# EAGLE board CntrlBoardV2_0 (EAGLE 7.7.0)
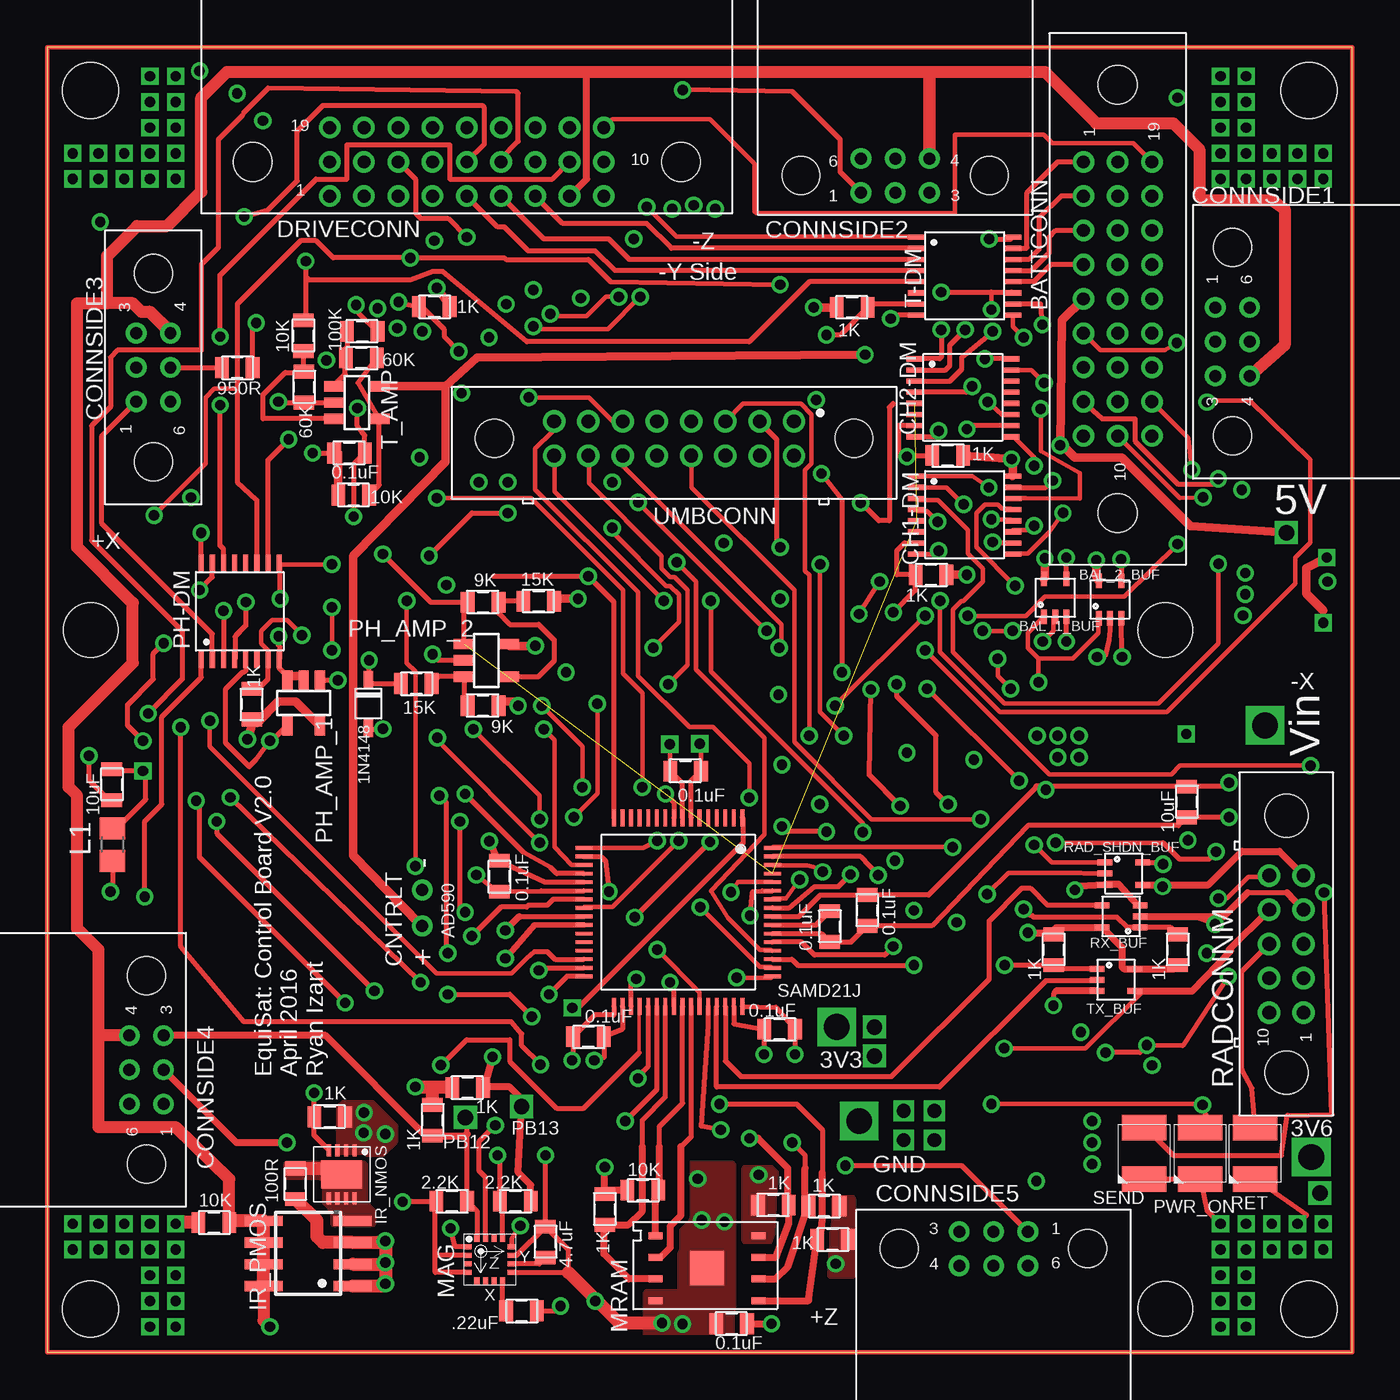
[diagram p9: board, top side]
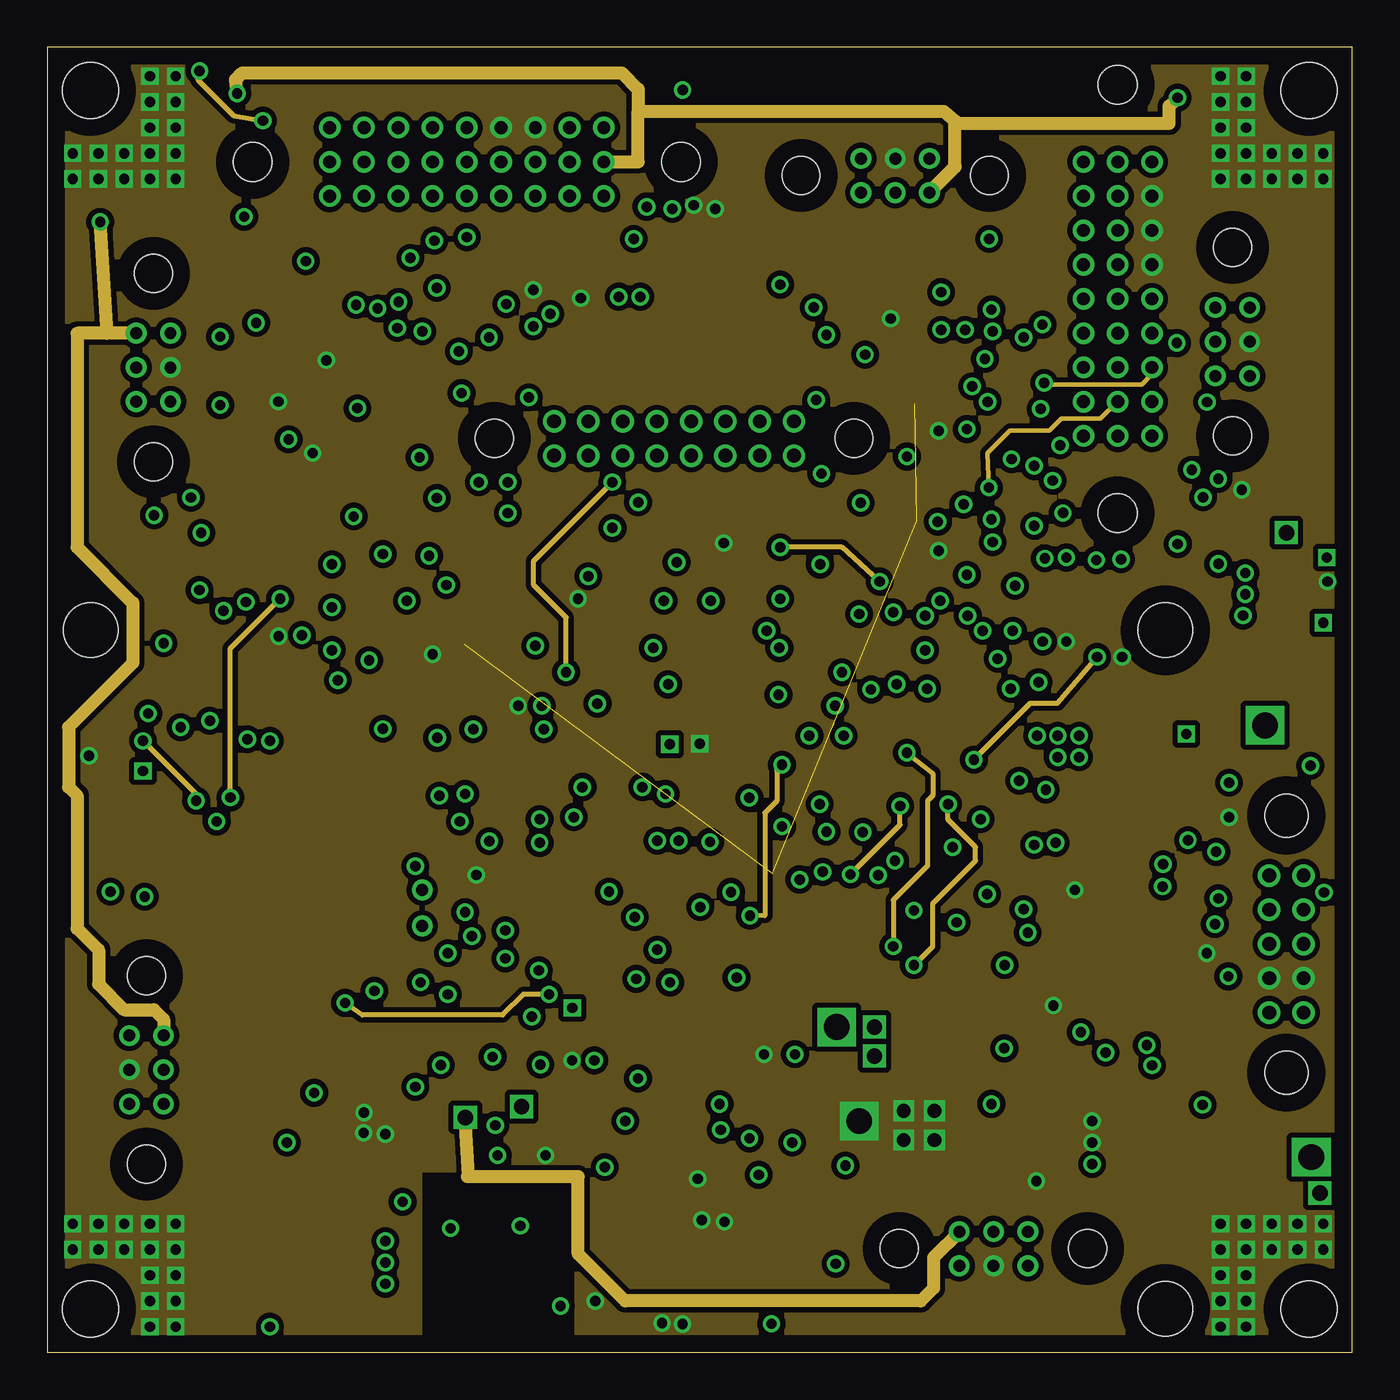
[diagram p10: board, inner layer Route2]
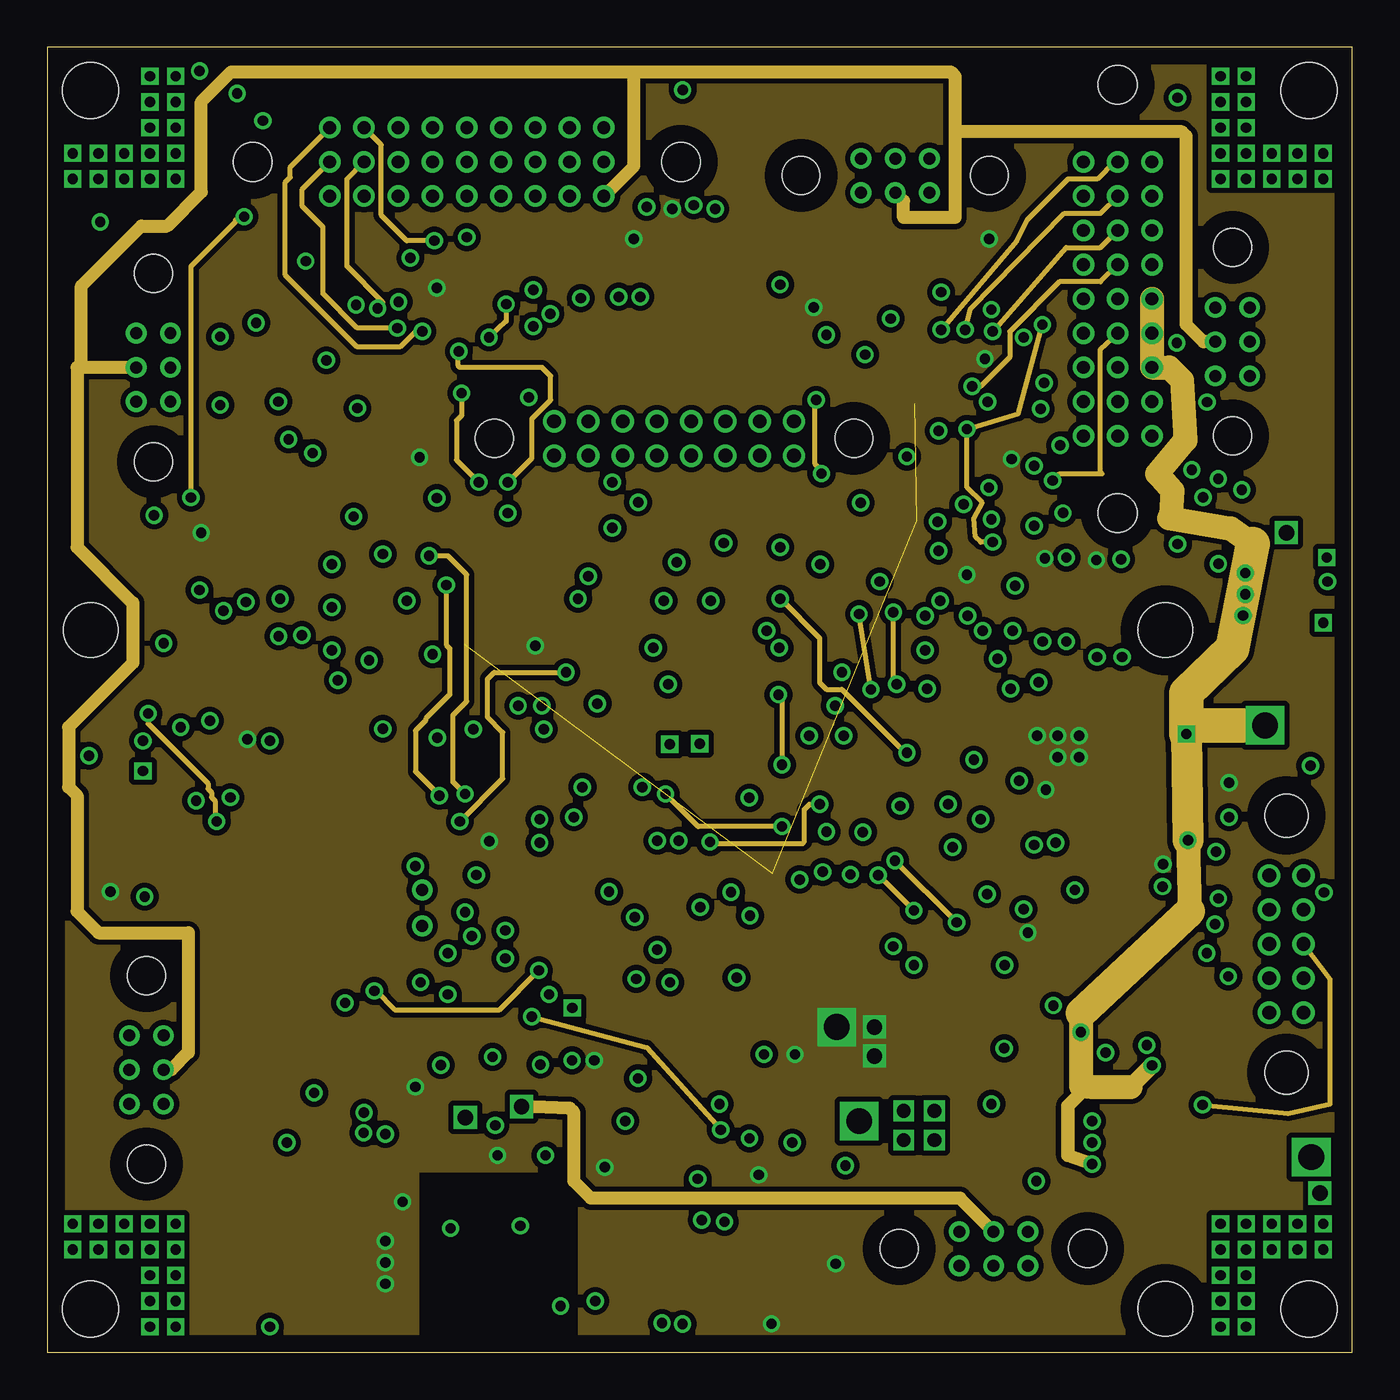
[diagram p11: board, inner layer Route3]
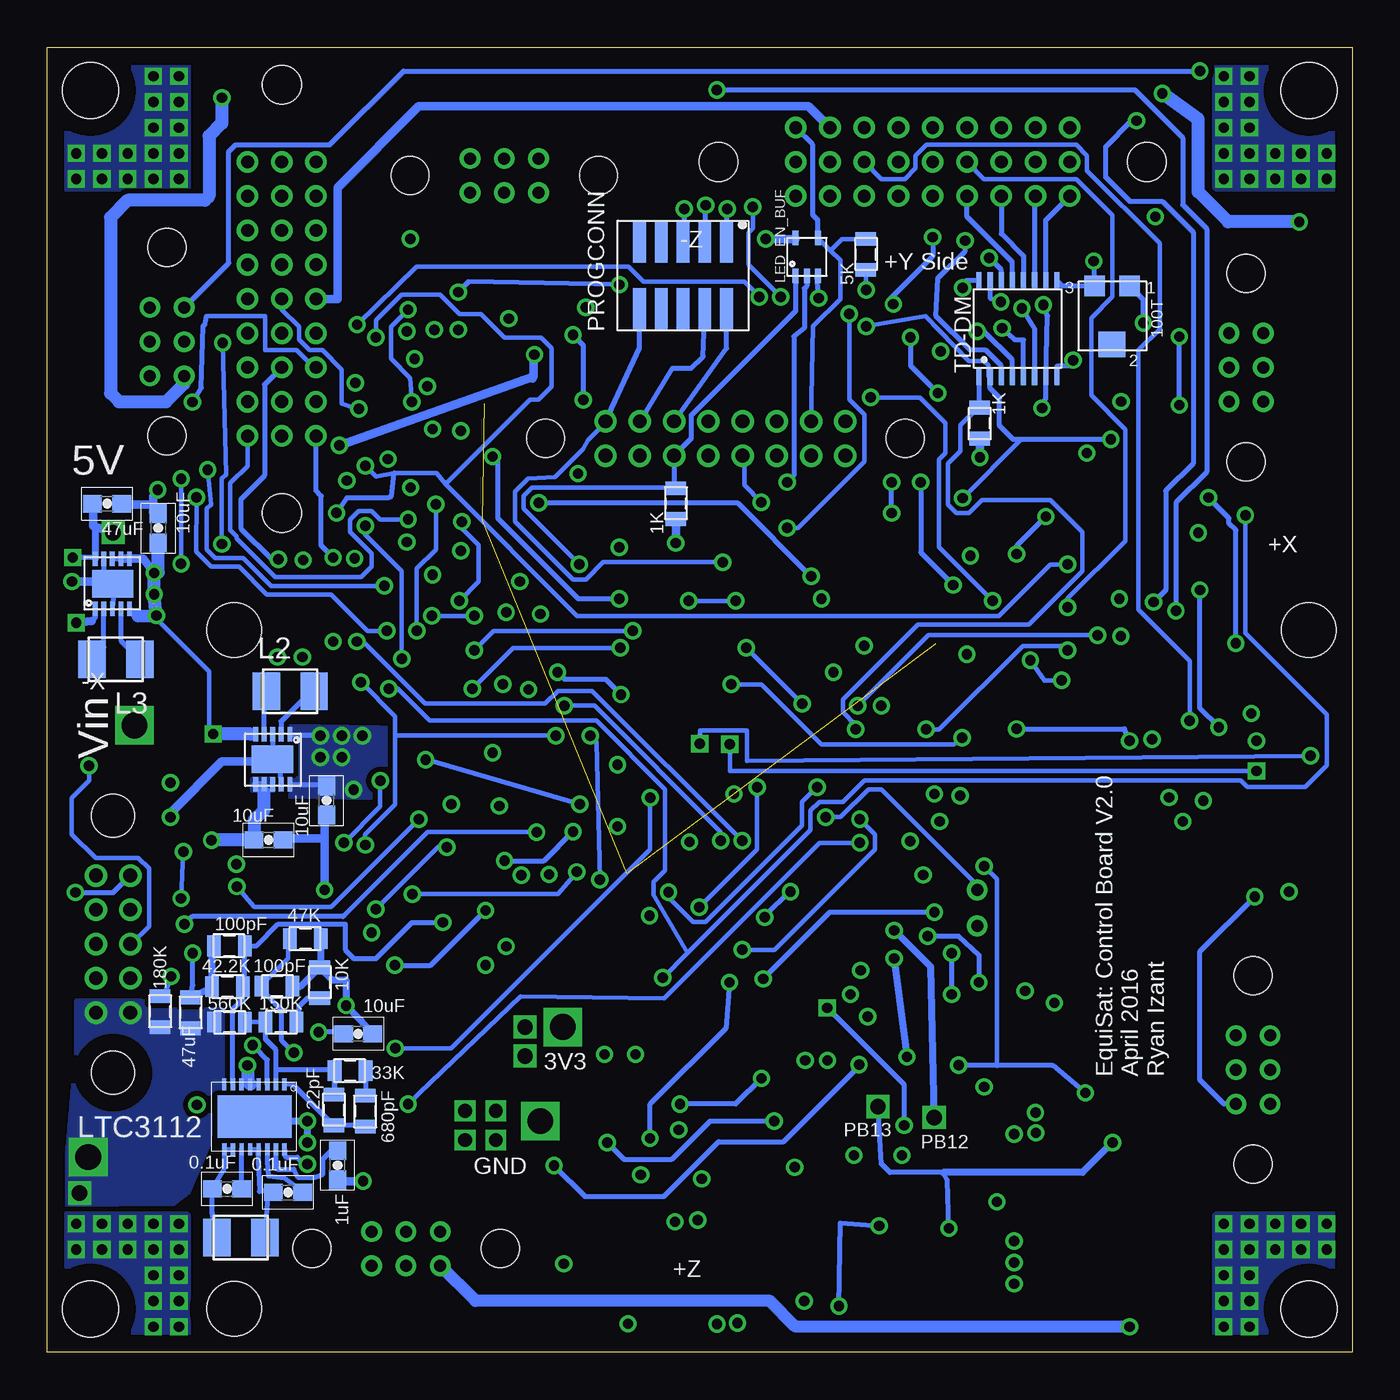
[diagram p12: board, bottom side, seen from below]

Size 76.2 x 76.2 mm. Coordinates in mm from the lower left corner, seen from the top.
Outline: 0,0 76.2,0 76.2,76.2 0,76.2 0,0
Copper layers (1*2*3*16): Top 0.035mm / dielectric 0.2mm / Route2 0.035mm / dielectric 0.2mm / Route3 0.035mm / dielectric 0.2mm / Bottom 0.035mm
Design rules "default *": minimum track width 6mil, minimum drill 15mil, track to track 5mil, track to pad 5mil, pad to pad 5mil, via to via 5mil, smd to smd 2mil, copper to edge 40mil, drill to drill 8mil, minimum pad ring 10mil, minimum via ring 8mil, stop-mask expansion 4mil, vias tented up to drill 0mil, thermal gap 10mil
Net classes: 0 default: width 0.254 mm, drill 0.203 mm, clearance 0.203 mm; 1 GND: width 0.508 mm, drill 0.254 mm, clearance 0.305 mm; 2 3V3: width 0.508 mm, drill 0.254 mm, clearance 0.305 mm; 3 3V6: width 1.016 mm, drill 0.254 mm, clearance 0.305 mm; 4 5V: width 0.508 mm, drill 0.254 mm, clearance 0.305 mm; 5 VIN: width 1.27 mm, drill 0.254 mm, clearance 0.305 mm
Holes 3.26 mm at 2.54,2.54 2.54,73.66 73.66,73.66 73.66,2.54
Holes 3.18 mm at 65.28,2.54 65.28,42.16 2.54,42.16

## Footprints (pad centres in the part's own frame; a part is rotated, then mirrored left to right if it is on the bottom)
SOD-323F = smd 0.55 x 1.05: ANODE 0,-2.8; CATHODE 0,0
TC33X-2 = smd 1.2 x 1.2: P$1 0,0; P$3 2.05,0 | smd 1.6 x 1.5: P$2 1.04,3.41
QFN10_POWERPAD = smd 0.28 x 0.85: P$1 0.14,0.441; P$2 0.641,0.441; P$3 1.141,0.442; P$4 1.639,0.439; P$5 2.139,0.442; P$6 2.14,3.359; P$7 1.639,3.359; P$8 1.139,3.355; P$9 0.641,3.355; P$10 0.139,3.358 | smd 2.4 x 1.6: PAD 1.155,1.898
SC70 = smd 0.35 x 0.85: P$1 0,0; P$2 0.65,0; P$3 1.3,0; P$4 1.3,2.2; P$5 0,2.2
HARWIN_DATAMATE_27 = drill 0.75: P$1 0,0; P$2 2,0; P$3 4,0; P$4 6,0; P$5 8,0; P$6 10,0; P$7 12,0; P$8 14,0; P$9 16,0; P$10 16,2; P$11 14,2; P$12 12,2; P$13 10,2; P$14 8,2; P$15 6,2; P$16 4,2; P$17 2,2; P$18 0,2; P$19 0,4; P$20 2,4; P$21 4,4; P$22 6,4; P$23 8,4; P$24 10,4; P$25 12,4; P$26 14,4; P$27 16,4 | hole 2.25: -4.5,2; 20.5,2
0805 = smd 0.8 x 1.2: 1 -0.9,0; 2 0.9,0
0603-CAP = smd 1.1 x 1: 1 -0.85,0; 2 0.85,0
TSSOP-16 = smd 1 x 0.3: P$1 -0.635,0; P$2 -0.635,-0.65; P$3 -0.635,-1.3; P$4 -0.635,-1.95; P$5 -0.635,-2.6; P$6 -0.635,-3.25; P$7 -0.635,-3.9; P$8 -0.635,-4.55; P$9 4.965,-4.55; P$10 4.965,-3.9; P$11 4.965,-3.25; P$12 4.965,-2.6; P$13 4.965,-1.95; P$14 4.965,-1.3; P$15 4.965,-0.65; P$16 4.965,0
AD590TH = drill 0.7: P$1 -2.1,0; P$2 0,0
HARWIN_DATAMATE_6_HOR = drill 0.7: P$1 2,1; P$2 0,1; P$3 -2,1; P$4 -2,-1; P$5 0,-1; P$6 2,-1 | hole 2.2: -5.5,0; 5.5,0
HARWIN_DATAMATE_6 = drill 0.7: P$1 -2,1; P$2 0,1; P$3 2,1; P$4 2,-1; P$5 0,-1; P$6 -2,-1 | hole 2.2: -5.5,0; 5.5,0
HARWIN_DATAMATE_27_HOR = drill 0.75: P$1 0,0; P$2 2,0; P$3 4,0; P$4 6,0; P$5 8,0; P$6 10,0; P$7 12,0; P$8 14,0; P$9 16,0; P$10 16,2; P$11 14,2; P$12 12,2; P$13 10,2; P$14 8,2; P$15 6,2; P$16 4,2; P$17 2,2; P$18 0,2; P$19 0,4; P$20 2,4; P$21 4,4; P$22 6,4; P$23 8,4; P$24 10,4; P$25 12,4; P$26 14,4; P$27 16,4 | hole 2.25: -4.5,2; 20.5,2
DFN3 = smd 0.25 x 0.7: P$1 0,0; P$2 0.5,0; P$3 1,0; P$4 1.5,0; P$5 1.5,2.8; P$6 1,2.8; P$7 0.5,2.8; P$8 0,2.8 | smd 2.38 x 1.65: P$9 0.75,1.4
SO08 = smd 0.6 x 2.2: 1 -1.905,-2.6; 2 -0.635,-2.6; 3 0.635,-2.6; 4 1.905,-2.6; 5 1.905,2.6; 6 0.635,2.6; 7 -0.635,2.6; 8 -1.905,2.6
R0805 = smd 1.3 x 1.5: 1 -0.95,0; 2 0.95,0
L3225M = smd 1.6 x 2.2: 1 -1.4,0; 2 1.4,0
DHD16 = smd 0.25 x 0.7: 1 0.125,0.35; 2 0.625,0.35; 3 1.125,0.35; 4 1.625,0.35; 5 2.125,0.35; 6 2.638,0.35; 7 3.125,0.35; 8 3.638,0.35; 9 3.625,4.15; 10 3.125,4.15; 11 2.625,4.15; 12 2.125,4.15; 13 1.625,4.15; 14 1.125,4.15; 15 0.625,4.15; 16 0.125,4.15 | smd 4.34 x 2.44: 17 1.875,2.25
HMC5883L = smd 0.45 x 0.3: 1 0.225,2.25; 2 0.225,1.75; 3 0.225,1.25; 4 0.225,0.75; 9 2.775,0.75; 10 2.775,1.25; 11 2.775,1.75; 12 2.775,2.25 | smd 0.3 x 0.45: 5 0.75,0.225; 6 1.25,0.225; 7 1.75,0.225; 8 2.25,0.225; 13 2.25,2.775; 14 1.75,2.775; 15 1.25,2.775; 16 0.75,2.775
8PXMO-229 = smd 0.813 x 0.406: P1 -3,1.895; P2 -3,0.635; P3 -3,-0.635; P4 -3,-1.895; P5 3,-1.895; P6 3,-0.635; P7 3,0.635; P8 3,1.895 | smd 2 x 2: P9 0,0
SOT23-5 = smd 0.6 x 1.2: IN+ 0.95,-1.306; IN- 0.95,1.306; OUT -0.95,-1.306; V+ -0.95,1.306; V- 0,-1.306
HARWIN_ARCHER_10_SMD = smd 0.74 x 2.4: 1 6.35,0; 2 5.08,0; 3 3.81,0; 4 2.54,0; 5 1.27,0; 6 1.27,-3.89; 7 2.54,-3.89; 8 3.81,-3.89; 9 5.08,-3.89; 10 6.35,-3.89
PLCC-2 = smd 2.6 x 1.5: A 0,0.75; C 0,-2.25
HARWIN_DATAMATE_10 = drill 0.8: P$1 0,0; P$2 2,0; P$3 4,0; P$4 6,0; P$5 8,0; P$6 8,2; P$7 6,2; P$8 4,2; P$9 2,2; P$10 0,2 | hole 2.5: -3.5,1; 11.5,1
TQFP-64 = smd 1 x 0.22: P$1 -5.5,3.5; P$2 -5.5,3; P$3 -5.5,2.5; P$4 -5.5,2; P$5 -5.5,1.5; P$6 -5.5,1; P$7 -5.5,0.5; P$8 -5.5,0; P$9 -5.5,-0.5; P$10 -5.5,-1; P$11 -5.5,-1.5; P$12 -5.5,-2; P$13 -5.5,-2.5; P$14 -5.5,-3; P$15 -5.5,-3.5; P$16 -5.5,-4; P$33 5.5,-4; P$34 5.5,-3.5; P$35 5.5,-3; P$36 5.5,-2.5; P$37 5.5,-2; P$38 5.5,-1.5; P$39 5.5,-1; P$40 5.5,-0.5; P$41 5.5,0; P$42 5.5,0.5; P$43 5.5,1; P$44 5.5,1.5; P$45 5.5,2; P$46 5.5,2.5; P$47 5.5,3; P$48 5.5,3.5 | smd 0.22 x 1: P$17 -3.75,-5.75; P$18 -3.25,-5.75; P$19 -2.75,-5.75; P$20 -2.25,-5.75; P$21 -1.75,-5.75; P$22 -1.25,-5.75; P$23 -0.75,-5.75; P$24 -0.25,-5.75; P$25 0.25,-5.75; P$26 0.75,-5.75; P$27 1.25,-5.75; P$28 1.75,-5.75; P$29 2.25,-5.75; P$30 2.75,-5.75; P$31 3.25,-5.75; P$32 3.75,-5.75; P$49 3.75,5.25; P$50 3.25,5.25; P$51 2.75,5.25; P$52 2.25,5.25; P$53 1.75,5.25; P$54 1.25,5.25; P$55 0.75,5.25; P$56 0.25,5.25; P$57 -0.25,5.25; P$58 -0.75,5.25; P$59 -1.25,5.25; P$60 -1.75,5.25; P$61 -2.25,5.25; P$62 -2.75,5.25; P$63 -3.25,5.25; P$64 -3.75,5.25
HARWIN_DATAMATE_16 = drill 0.8: P$1 0,0; P$2 2,0; P$3 4,0; P$4 6,0; P$5 8,0; P$6 10,0; P$7 12,0; P$8 14,0; P$9 14,2; P$10 12,2; P$11 10,2; P$12 8,2; P$13 6,2; P$14 4,2; P$15 2,2; P$16 0,2 | hole 2.2: -3.5,1; 17.5,1

## Placement (x,y rotation side)
1N4148  1N4148WS  [SOD-323F]  18.75,39.25 0 top
100T  TRIMPOT-TC33  [TC33X-2]  13,62.25 180 bottom
63001  TPS6300X  [QFN10_POWERPAD]  61.89,36.52 180 bottom
63002  TPS6300X  [QFN10_POWERPAD]  73.53,42.98 0 bottom
BAL_1_BUF  SN74LVC1G125  [SC70]  58.2,42.95 0 top
BAL_2_BUF  SN74LVC1G125  [SC70]  61.4,42.85 0 top
BATTCONN  HARWIN_27  [HARWIN_DATAMATE_27]  60.5,69.5 270 top
C1  4.7uF  [0805]  29.09,6.44 90 top
C2  0.1uF  [0805]  37.27,33.94 180 top
C3  0.1uF  [0805]  26.41,27.8 270 top
C4  0.1uF  [0805]  45.69,24.86 90 top
C5  0.1uF  [0805]  42.76,18.86 0 top
C6  0.1uF  [0805]  31.6,18.42 0 top
C7  0.1uF  [0805]  47.87,25.8 90 top
C8  10uF  [0805]  3.77,33.14 90 top
C9  10uF  [0805]  66.52,32.13 90 top
C10  .22uF  [0805]  27.69,2.43 0 top
C11  10uF  [0603-CAP]  59.89,32.22 90 bottom
C12  10uF  [0603-CAP]  63.28,29.91 0 bottom
C14  10uF  [0603-CAP]  69.71,48.11 270 bottom
C15  47uF  [0603-CAP]  72.7,49.54 180 bottom
C17  0.1uF  [0805]  17.65,52.5 180 top
C18  0.1uF  [0805]  39.96,1.67 180 top
C19  10uF  [0603-CAP]  58.04,18.6 0 bottom
C20  47uF  [0805]  67.83,19.82 90 bottom
C21  0.1uF  [0603-CAP]  65.7,9.55 180 bottom
C22  0.1uF  [0603-CAP]  62.14,9.34 180 bottom
C23  1uF  [0603-CAP]  59.25,10.93 90 bottom
C26  100pF  [0805]  62.78,21.37 0 bottom
C27  100pF  [0805]  65.56,23.73 180 bottom
C28  22pF  [0805]  59.47,14.15 90 bottom
C29  680pF  [0805]  57.62,14.09 270 bottom
CH1-DM  SN74CBTLV3251  [TSSOP-16]  51.4,51.15 0 top
CH2-DM  SN74CBTLV3251  [TSSOP-16]  51.3,58 0 top
CNTRLT  AD590-TH  [AD590TH]  21.9,27 90 top
CONNSIDE1  HARWIN_06_HOR  [HARWIN_DATAMATE_6_HOR]  69.2,59 90 top
CONNSIDE2  HARWIN_06_HOR  [HARWIN_DATAMATE_6_HOR]  49.51,68.7 180 top
CONNSIDE3  HARWIN_06  [HARWIN_DATAMATE_6]  6.2,57.5 90 top
CONNSIDE4  HARWIN_06_HOR  [HARWIN_DATAMATE_6_HOR]  5.8,16.5 270 top
CONNSIDE5  HARWIN_06_HOR  [HARWIN_DATAMATE_6_HOR]  55.25,6.05 0 top
DRIVECONN  HARWIN_27_HOR  [HARWIN_DATAMATE_27_HOR]  16.5,67.5 0 top
IR_NMOS  AON7522E  [DFN3]  17.95,11.8 180 top
IR_PMOS  POWERPMOS  [SO08]  15.24,5.78 90 top
L1  BLM21PG221SN1D  [R0805]  3.82,29.64 90 top
L2  2.2uH  [L3225M]  62.01,38.59 0 bottom
L3  3.3uH  [L3225M]  72.19,40.46 180 bottom
L4  4.7uH  [L3225M]  64.89,6.71 180 bottom
LED_EN_BUF  SN74LVC1G125  [SC70]  32.5,62.85 0 bottom
LTC3112  [DHD16]  62.22,16.01 180 bottom
MAG  HMC5883L  [HMC5883L]  24.34,3.92 0 top
MRAM  [8PXMO-229]  38.52,4.92 0 top
PH-DM  SN74CBTLV3251  [TSSOP-16]  9,41.1 90 top
PH_AMP_1  LT6015  [SOT23-5]  14.97,37.91 180 top
PH_AMP_2  LT6015  [SOT23-5]  25.65,40.4 270 top
PROGCONN  HARWIN_ARCHER_10_SMD  [HARWIN_ARCHER_10_SMD]  42.89,64.82 0 bottom
PWR_ON  LT-T673-Q1R2-25-Z  [PLCC-2]  67.31,12.37 0 top
R1  2.2K  [0805]  27.33,8.83 0 top
R2  2.2K  [0805]  23.62,8.83 0 top
R3  560K  [0805]  65.55,19.27 0 bottom
R4  150K  [0805]  62.55,19.29 0 bottom
R5  60K  [0805]  15,56.35 90 top
R6  47K  [0805]  61.12,24.14 180 bottom
R7  180K  [0805]  69.61,19.89 90 bottom
R8  42.2K  [0805]  65.67,21.36 0 bottom
R9  10K  [0805]  60.29,21.58 90 bottom
R10  33K  [0805]  58.51,16.44 180 bottom
R11  1K  [0805]  58.75,23.5 90 top
R12  10K  [0805]  17.9,50.05 180 top
R13  60K  [0805]  18.35,58.05 0 top
R14  100K  [0805]  18.4,59.6 180 top
R15  10K  [0805]  14.95,59.35 90 top
R16  950R  [0805]  11.1,57.49 0 top
R17  10K  [0805]  9.74,7.59 0 top
R18  1K  [0805]  21.75,54.25 270 bottom
R19  1K  [0805]  22.6,61.05 0 top
R20  1K  [0805]  47,61 180 top
R21  1K  [0805]  11.95,37.85 270 top
R22  1K  [0805]  51.6,45.4 0 top
R23  10K  [0805]  34.78,9.47 0 top
R24  1K  [0805]  24.55,15.45 180 top
R25  1K  [0805]  22.5,13.55 90 top
R26  1K  [0805]  32.55,8.35 90 top
R27  1K  [0805]  42.4,8.6 180 top
R28  1K  [0805]  45.85,6.6 0 top
R29  1K  [0805]  45.35,8.55 0 top
R30  100R  [0805]  14.5,9.85 270 top
R31  1K  [0805]  52.57,52.36 0 top
R32  15K  [0805]  21.55,39.05 0 top
R33  9K  [0805]  25.45,37.75 180 top
R34  9K  [0805]  25.45,43.8 180 top
R35  15K  [0805]  28.7,43.85 180 top
R36  1K  [0805]  39.5,49.55 90 bottom
R37  5K  [0805]  28.4,64.1 90 bottom
R38  1K  [0805]  66,23.5 90 top
R40  1K  [0805]  16.5,13.75 180 top
RAD_SHDN_BUF  SN74LVC1G125  [SC70]  61.75,28.6 270 top
RADCONNM  HARWIN_10  [HARWIN_DATAMATE_10]  73.34,19.84 90 top
RET  LT-T673-Q1R2-25-Z  [PLCC-2]  70.52,12.37 0 top
RX_BUF  SN74LVC1G125  [SC70]  63.8,24.8 90 top
SAMD21J  SAMD21JTQFP-64  [TQFP-64]  37.09,25.7 270 top
SEND  LT-T673-Q1R2-25-Z  [PLCC-2]  64.03,12.37 0 top
T-DM  SN74CBTLV3251  [TSSOP-16]  51.4,65.1 0 top
T_AMP  LT6015  [SOT23-5]  18.09,55.45 270 top
TD-DM  [TSSOP-16]  21.8,57.6 90 bottom
TX_BUF  SN74LVC1G125  [SC70]  61.3,22.4 270 top
UMBCONN  HARWIN_16  [HARWIN_DATAMATE_16]  43.6,54.35 180 top

## Tracks (layer width: path | path; a pad name or v marks a point on that pad's centre or on a via)
3V3  (via drill 0.6, 0.9, 1.5)
  Top 0.3: C7.2 51.45,26.7 57.78,33.03 C9.2 68.78,33.03 v69,33.25 | v55,65 56.27,65 T-DM.P$16 | PH-DM.P$16 v9,47.85 | CH2-DM.P$16 v54.75,58 | RAD_SHDN_BUF.P$5 65.05,28.6 v65.15,28.5
  Top 0.305: SAMD21J.P$56 43.89,25.45 45.14,26.7 C7.2 | L1.1 3.82,27.02 v3.7,26.9 | SAMD21J.P$48 42.55,20.15 C5.2 v43.66,17.4 | SAMD21J.P$34 33.59,18.86 C6.2 32.5,17.2 v31.94,17.05 | v26.3,11.5 26.43,11.37 R1.1 26.59,8.67 MAG.13 | MAG.4 22.66,4.67 22.66,5.59 | 22.66,5.59 22.66,8.77 | 22.66,8.77 R2.1 | MAG.2 22.74,5.67 22.66,5.59 | 22.66,8.77 22.64,8.79 v20.75,8.79 | C3.1 29.06,27.45 SAMD21J.P$21
  Top 0.406: v25.82,29.84 26.31,28.75 C3.1 | C18.1 v42.29,1.67 | v32.55,10.81 R26.2 32.77,9.47 R23.1 | v57.25,24.5 58.75,24.5 R11.2 58.9,24.8 RX_BUF.P$5 62.75,23.65 62.75,22.5 62.85,22.4 TX_BUF.P$5 65.8,22.4 arc90 R38.1 | 57.78,33.03 58.4,33.03 v58.3,32.85
  Top 0.508: v58.25,46.35 58.25,45.25 BAL_1_BUF.P$5 | v61.25,46.25 61.25,45.25 BAL_2_BUF.P$5 | v11.7,35.8 12,36.75 R21.2 12.25,36.75 13.5,38 14.5,38 15.75,36.75 PH_AMP_1.V+ | v28.5,41.25 27,41.25 PH_AMP_2.V+ | v22.75,62.15 23.55,61.05 R19.2 | v53.7,45.4 R22.2 | R31.2 55.2,52.25 v56.3,52.15 56.38,52 56.38,51.25 CH1-DM.P$16 | v44.75,61 R20.2
  Top 0.76: v21.5,15.5 22.5,15.5 | 22.5,15.5 23.6,15.5 R24.2 | R25.2 22.5,15.5 | IR_PMOS.1 19.62,3.88 v19.75,4 19.75,6.42 IR_PMOS.3 16.09,6.42 15.75,6.75 15.75,7.7 R30.2 | IR_PMOS.2 19.64,5.14 v19.75,5.25
  Route2 0.406: v58.3,32.85 58.4,33.03
  Bottom 0.3: v36.5,66.75 36.54,66.71 PROGCONN.1 | TD-DM.P$16 22.57,62.56 v22.75,62.15 | v60.25,36 61.95,36 63001.P$1 | 63001.P$10 59.98,33.16 C11.2
  Bottom 0.508: v34.25,65 32.5,65 LED_EN_BUF.P$5 | v21.75,52.25 R18.2
  other vias: 46.04,5.17 41.54,10.37 19.75,6.5 59,36 59,34.75 60.25,34.75 46.1,19 48.3,19 48.3,17.3 57.8,36
  pour Route3 (no thermals): 82.7,80.7 82.7,-6.3 31.2,-6.3 31.2,10.7 21.5,10.7 21.5,-6.9 -5.5,-6.9 -5.5,80.8
  pour Top (no thermals): 42.5,10.5 42.25,6.5 40.75,6.5 40.75,10.75 42.5,10.75
  pour Top (no thermals): 47,9 47,4.5 45.75,4.5 46,9
  pour Bottom (no thermals): 55.1,32.4 62.25,32.5 62.25,33.5 61.5,33.5 61.5,35.75 62,35.75 62,36.5 55.1,36.4
3V3D  (via drill 0.6)
  Top 0.41: DRIVECONN.P$8 31.5,68.5 31.5,74.75
  Top 0.71: R17.2 10.64,10.11 7.5,13.15 3,13.15 3,18.5 | CONNSIDE4.P$4 3,18.5 | 3,18.5 3,23.5 1.75,24.75 1.75,32.5 1.25,33 1.25,36.5 5,40.25 5,43.75 1.75,47 1.75,61.25 3.5,61.25 | 5.95,60.75 5.5,60.75 5,61.25 3.5,61.25 | 5.95,60.75 CONNSIDE3.P$4 7.2,59.55 6,60.75 5.95,60.75 | 3.5,61.25 3.5,64 5.25,65.75 7,65.75 9,67.75 9,73.25 10.5,74.75 31.5,74.75 51.5,74.75 | 51.5,74.75 CONNSIDE2.P$4 51.51,74.74 51.5,74.75 | 51.5,74.75 58.25,74.75 61.25,71.75 65.75,71.75 67.25,70.25 67.25,67.5 67.5,67.25 71.5,67.25 72.25,66.75 72.25,58.8 CONNSIDE1.P$4 | IR_PMOS.7 12.64,1.86 v13,1.5
  Top 0.76: IR_PMOS.8 IR_PMOS.7 IR_PMOS.6 IR_PMOS.5 10.64,7.68 R17.2
  Bottom 0.71: v13,1.5 32.5,1.5 34,3 51.2,3 CONNSIDE5.P$4
3V6  (via drill 0.9, 1.5)
  other vias: 73.8,11.4 74.3,9.3
  pour Bottom (no thermals): 70.75,20.5 74.5,20.5 74.5,17.5 75.3,8.65 68.8,8.7 67.95,9.35 65.45,15.25 65.75,19.75 66,20 69.5,20
5V  (via drill 0.6, 0.9)
  Top 0.3: 74.5,43.3 v74.5,42.6
  Top 0.5: v74.7,46.4 73.5,45.8 73.5,44.3 74.5,43.3
  Top 0.508: v72.35,47.85 66.75,48.25 62.75,52.25 60,52.25 59.25,53 v59.14,52.95 59.25,60.25 BATTCONN.P$5 | 23.25,56.4 T_AMP.V+ | 23.25,56.4 25.11,58.08 v47.75,58.25 | 23.25,56.4 23.25,52 17.87,46.5 17.87,29 21.75,25 CNTRLT.P$1
  Bottom 0.3: 73.5,48.25 73.39,48.14 | 63002.P$10 73.45,46.4 v74.7,46.4 | 73.6,42.7 73.39,42.91 63002.P$1
  Bottom 0.4: 73.39,48.14 63002.P$10
  Bottom 0.5: v74.5,42.6 73.6,42.7
  Bottom 0.508: v72.35,47.85 73.5,48.25 73.5,49.5 C15.2 | DRIVECONN.P$26 31.75,72.75 54.5,72.75 59.25,68 59.25,61.5 BATTCONN.P$5
  Bottom 0.51: v59.14,52.95 47.8,56.95 | 47.8,56.95 47.85,56.85 | v47.75,58.25 47.8,58.25 47.8,56.95
AMBTEMP
  Top 0.3: T-DM.P$4 33.15,63.15 32,64.3 28.1,64.3 26.7,65.7 26.3,65.7 DRIVECONN.P$5
BATT1TEMP
  Top 0.3: T-DM.P$15 57.15,64.45 57.2,64.5 57.2,67.7 59,69.5 BATTCONN.P$1
BATT2TEMP
  Top 0.3: BATTCONN.P$2 59.2,67.5 57.9,66.2 57.9,64.4 57.3,63.8 T-DM.P$14
BATT3TEMP
  Top 0.3: T-DM.P$13 57.45,63.15 58.5,64.2 58.5,65.1 58.9,65.5 BATTCONN.P$3
BATT4TEMP
  Top 0.3: BATTCONN.P$4 58.6,63.5 57.6,62.5 T-DM.P$12
CNTRLTEMP  (via drill 0.61)
  Top 0.254: v35,66.88 36.75,65.12 50.75,65.12 T-DM.P$1 | v33.38,61.62 32.62,61.62 31.5,60.5 29.5,60.5 v29.38,60.62 | v33,48.12 33,47.88 36.12,44.75 36.38,44.75 36.88,44.25 36.88,42.62 v35.38,41.12 | v32.12,37.88 32.12,32.62 v30.75,31.25
  Bottom 0.254: v35,66.88 35,65.62 35.25,65.38 35.25,63.5 v33.38,61.62 | v29.38,60.62 29.38,55.62 28.5,54.75 28.5,52 32.38,48.12 v33,48.12 | v32.12,37.88 v35.38,41.12 | v30.75,31.25 29.88,31.25 28.25,32.88 27.5,32.88 22,27.38 22,27 CNTRLT.P$2
DRIVE3TEMP
  Top 0.3: T-DM.P$3 34,63.8 32.8,65 29,65 DRIVECONN.P$6
DRIVE4TEMP
  Top 0.3: T-DM.P$2 36.45,64.45 35,65.9 30.1,65.9 DRIVECONN.P$7
DRIVE_SENSE_1  (via drill 0.6)
  Route3 0.3: v19.3,60.95 19.6,61.3 17.5,63.4 17.5,68.5 DRIVECONN.P$17
  Bottom 0.3: TD-DM.P$6 18.55,59.75 v19.3,60.95
DRIVE_SENSE_2  (via drill 0.6)
  Route3 0.3: v20.45,59.8 18.1,59.8 16.1,61.8 16.1,65.7 14.9,66.9 14.9,67.9 DRIVECONN.P$18
  Bottom 0.3: TD-DM.P$5 19.2,59.1 19.7,59.1 v20.45,59.8
DRIVE_SENSE_3  (via drill 0.6)
  Route3 0.3: v21.9,59.6 21.5,59.6 20.6,58.7 18.1,58.7 13.9,62.9 13.9,68.3 14.2,68.6 14.2,69.2 DRIVECONN.P$19
  Bottom 0.3: TD-DM.P$4 19.85,57.95 21.5,59.6 v21.9,59.6
DRIVE_SENSE_4  (via drill 0.6)
  Route3 0.3: v22.6,64.9 21,64.9 19.5,66.4 19.5,70.5 DRIVECONN.P$20
  Bottom 0.3: TD-DM.P$3 20.5,57.6 21.4,58.5 22.3,58.5 24.3,60.5 24.2,62.7 22.6,64.3 v22.6,64.9
GND  (via drill 0.6, 0.8, 1.5)
  Top 0.254: v38.1,35.53 38.17,35.53 C2.1
  Top 0.3: RET.C 73.53,8.03 v73,7.5 | SEND.C PWR_ON.C | 67.61,10.12 PWR_ON.C | PWR_ON.C 67.71,8.29 v68.5,7.5 | 58.9,21.1 58.75,20.95 v58.75,20.25 | C7.1 51.65,24.9 57.25,30.75 66.04,30.75 C9.1 68.98,31.23 v69,31.25 | CONNSIDE3.P$5 R16.1 | v13.5,55.5 13.55,55.45 R5.1 T_AMP.V- | v15.5,52.5 C17.2 | PH_AMP_2.V- 22.85,40.4 v22.5,40.75 | T-DM.P$8 49.47,60.56 v49.25,60.35 | 14,39.5 13.55,39.95 PH-DM.P$8 13.6,40.52 13.6,41.2 13.52,41.28 v13.52,41.8 | CH2-DM.P$8 51.8,53.45 v52.05,53.8 | CH1-DM.P$8 51.85,46.6 v52.05,46.8 | v59.5,41.5 BAL_1_BUF.P$3 | v62.75,40.6 BAL_2_BUF.P$3 | 33.09,19.69 31.97,19.69 C6.1
  Top 0.305: SAMD21J.P$54 45.2,24.45 C4.1 46.93,23.96 C7.1 | v25.05,27.87 25.96,27.15 C3.2 28.86,26.95 SAMD21J.P$22 | SAMD21J.P$47 40.09,19.19 C5.1 v41.86,17.4 | SAMD21J.P$33 33.09,19.69 | C6.1 30.7,17.11 v30.64,17.05 | C1.2 v29.1,11.5 | MAG.11 27.42,5.67 C1.2 | MAG.9 30.43,4.67 30.43,6 C1.2 | SAMD21J.P$7 37.59,33.36 C2.1 | C8.1 3.6,32.24 2.46,33.38 2.46,34.85 v2.44,34.83
  Top 0.406: TX_BUF.P$3 58.9,21.1 | v60,27 60.2,27.2 RAD_SHDN_BUF.P$3 61.77,27.32 62.56,27.32 63.68,26.1 RX_BUF.P$3
  Top 0.508: PH_AMP_1.V- 15,39.5 14,39.5 PH_AMP_1.IN+ | R33.1 26.5,38 27.5,38 v27.5,37.75 | R12.2 17,52.5 C17.2 | v31,44 29.5,44 R35.1
  Top 0.76: R17.1 7.59,7.59 v7.5,7.5 | 30.43,4.67 33.38,1.72 v35.9,1.72
  Bottom 0.25: R37.1 28.4,62 v28.39,62.02
  Bottom 0.254: v2.44,34.83 35.33,34.52 35.33,36.3 38.1,36.3 v38.1,35.53
  Bottom 0.3: v37.75,66.97 37.81,66.69 PROGCONN.2 | PROGCONN.3 39,64.9 v39,66.75 | 63002.P$9 72.9,46.33 72.9,45 | C20.2 67.7,21.45 v67.7,23.3 | TD-DM.P$8 17.25,57.55 17.2,57.6 16.45,57.6 v16.3,57.92 | v31.15,61.55 31.25,62.8 LED_EN_BUF.P$3
  Bottom 0.305: 63002.PAD 72.19,45.49 63002.P$3 | 63001.P$9 62.68,34.53 63001.PAD 62.93,34.01 63001.P$3
  Bottom 0.406: C20.2 66.61,21.32 R8.1 66.57,23.62 C27.2 | R6.1 60.22,22.55 R9.2 | R9.2 59.56,21.75 58.75,21.75 v58.75,20.25 57.89,19.39 C19.2 | C26.2 61.4,21.37 R9.2 | v61,12.25 v61,13.5 63.84,13.5 LTC3112.17
  Bottom 0.508: v57.75,10 59,10 C23.1 | v60,27 60,30 | 60,30 60,31 C11.1 | 60,30 62,30 C12.2 | 70,49.5 70,50 v69.75,50.35 | 70,49.5 70,49 C14.1 70,49.5 | 70,49.5 71.5,49.5 C15.1 | v39.5,47.25 R36.1 | v74.75,45 72.9,45 72.5,45 63002.PAD | 63001.PAD 63.5,34.5 66,34.5 69,31.5 v69,31.25
  other vias: 37.09,1.66 1.5,7.5 3,7.5 4.5,7.5 6,7.5 7.5,6 6,6 4.5,6 3,6 1.5,6 6,4.5 7.5,4.5 7.5,3 6,3 6,1.5 7.5,1.5 68.5,6 68.5,4.5 68.5,3 68.5,1.5 70,7.5 70,6 70,4.5 70,3 70,1.5 71.5,7.5 74.5,7.5 74.5,6 73,6 71.5,6 68.5,68.5 70,68.5 71.5,68.5 73,68.5 74.5,68.5 74.5,70 73,70 71.5,70 70,70 68.5,70 68.5,71.5 68.5,73 68.5,74.5 70,74.5 70,73 70,71.5 7.5,68.5 7.5,70 7.5,71.5 7.5,73 7.5,74.5 6,74.5 6,73 6,71.5 6,70 6,68.5 4.5,68.5 3,68.5 1.5,68.5 1.5,70 3,70 4.5,70 18.5,14 18.48,12.82 19.75,12.75 32,3 38.21,7.73 39.54,7.62 37.99,10.13 47.4,13.5 50,14.1 51.8,14.1 51.8,12.4 50,12.4
  pour Route2 (no thermals): 83.7,81.1 83.7,-6.6 31,-6.6 31,10.7 21.7,10.7 21.7,-7 -6.8,-7 -7.3,80
  pour Bottom (no thermals): 8,88 8,68 -12,68 -12,88
  pour Bottom (no thermals): 88,88 88,68 68,68 68,88
  pour Bottom (no thermals): 88,8 88,-12 68,-12 68,8
  pour Bottom (no thermals): 8,8 8,-12 -12,-12 -12,8
  pour Top (no thermals): 35,3.5 37,3.5 37,11 40,11 40,0.5 35,0.5
  pour Top (no thermals): 17,14.25 17,11.59 16.98,11.57 19.6,11.57 20.36,12.33 20.36,13.21 18.99,14.58 17.28,14.58 17.02,14.32 17.02,14.27
IR_PW_MID
  Top 0.76: R30.1 16.85,10.75 IR_NMOS.P$9
  pour Top (no thermals): 18.5,11 18.5,8.75 19,8.25 19,7.5 16.75,7.5 16.75,8.25 16.25,8.75 16.25,10 16,10.25 14,10.25 14,11
LED1TEMP
  Bottom 0.3: TD-DM.P$10 17.9,66.1 DRIVECONN.P$1
LED2TEMP
  Bottom 0.3: TD-DM.P$11 18.55,67.45 DRIVECONN.P$2
LED3TEMP
  Bottom 0.3: DRIVECONN.P$3 20.5,65.3 19.2,64 TD-DM.P$12
LED4TEMP
  Bottom 0.3: TD-DM.P$13 19.85,63.65 22.5,66.3 DRIVECONN.P$4
LFE_1_MP_EN  (via drill 0.6)
  Top 0.3: BAL_1_BUF.P$4 v59.5,46.4
  Bottom 0.3: v59.5,46.4 60.2,47.1 60.2,50 60.5,50.3 BATTCONN.P$9
LFE_1_MP_NCH  (via drill 0.61)
  Top 0.254: CH1-DM.P$2 52.5,50.5 v53.5,49.5 | v56.38,42.12 v54.62,42.12 | v67.48,49.91 66.12,49.88 BATTCONN.P$10
  Bottom 0.254: v53.5,49.5 53.5,46.88 54.62,45.75 v54.62,42.12 | v56.38,42.12 57.5,42.12 59.62,44.25 63.38,44.25 65,45.88 66.62,45.88 67.5,46.75 v67.48,49.91
LFE_1_MP_NFLT  (via drill 0.6)
  Top 0.25: v54.98,50.48 54.01,51.16 CH1-DM.P$1
  Route2 0.25: BATTCONN.P$11 61.5,54.5 59.2,54.5 58.5,53.8 56.2,53.8 54.9,52.5 v54.98,50.48
LFE_1_SENSE  (via drill 0.61)
  Top 0.254: v56.5,44.75 54.25,47 54.25,49 54.75,49.5 55.5,49.5 55.75,49.25 56.25,49.25 CH1-DM.P$13 | v66.83,51.52 66.62,53.38 BATTCONN.P$26
  Bottom 0.254: v56.5,44.75 63.12,44.75 64.75,46.38 66.38,46.38 66.88,46.88 66.88,49.25 66.62,49.5 v66.83,51.52
LFE_1_V  (via drill 0.6)
  Top 0.3: v54,56.4 53.65,56.05 CH2-DM.P$4
  Route3 0.3: BATTCONN.P$15 61.5,62.5 59.1,62.5 56.2,59.6 56.2,58.1 54.5,56.4 v54,56.4
LFE_2_MP_EN  (via drill 0.6)
  Top 0.3: v62.7,46.3 BAL_2_BUF.P$4
  Bottom 0.3: BATTCONN.P$12 63.5,56.5 63.5,51.2 64.9,49.8 64.9,48.1 63.1,46.3 v62.7,46.3
LFE_2_MP_NCH  (via drill 0.6)
  Top 0.3: CH1-DM.P$15 58.3,50.5 v58.7,50.9
  Route3 0.3: v58.7,50.9 59.1,51.3 61.6,51.3 61.5,51.4 61.5,58.58 BATTCONN.P$13
LFE_2_MP_NFLT  (via drill 0.61)
  Top 0.254: 56.25,49.88 CH1-DM.P$14 56.38,49.88 57.12,49.88 60.3,49.85 60.3,51.33 58,52.62 v58,55.08
  Bottom 0.254: BATTCONN.P$14 62.5,60.88 61.5,59.88 61.5,59.12 60.88,58.5 60.12,58.5 59,57.38 59,55.38 v58,55.08
LFE_2_SENSE  (via drill 0.61)
  Top 0.254: v55.12,48.62 56.25,48.62 CH1-DM.P$12
  Bottom 0.254: v55.12,48.62 56.75,48.62 57.25,49.12 58,49.12 58.5,48.62 58.5,47.88 57.25,46.62 57.25,45.88 57.88,45.25 62.88,45.25 65.12,47.5 65.12,47.62 65.5,48 65.5,50.75 64.5,51.75 BATTCONN.P$27
LFE_2_V  (via drill 0.6)
  Top 0.3: CH2-DM.P$3 52.7,56.7 53.4,57.4 53.4,58.1 v55.2,59.6
  Route3 0.3: v55.2,59.6 55.6,60 59.5,64.5 61.5,64.5 BATTCONN.P$16
LFE_3_V  (via drill 0.6)
  Top 0.3: CH2-DM.P$2 52.45,57.35 52.7,57.6 52.7,58.8 v53.6,59.7
  Route3 0.3: v53.6,59.7 53.9,60.9 59.4,66.5 61.5,66.5 BATTCONN.P$17
LFE_4_V  (via drill 0.6)
  Top 0.3: v52.2,59.7 52.2,58.1 52.1,58 CH2-DM.P$1
  Route3 0.3: BATTCONN.P$18 62.3,69.5 61.3,68.5 59.6,68.5 57.2,66.1 56.6,64.9 v52.2,59.7
LITH_MP_NCH  (via drill 0.61)
  Top 0.254: v52,48.5 51.38,49.12 50.88,49.12 CH1-DM.P$4 | v52.12,43.88 52.12,40.88 55.62,37.38 65.38,37.38 72.88,44.88 72.88,46.4 73.75,47.27 73.75,52.12 70.2,55.58 68.03,55.58 v67.72,55.48
  Bottom 0.254: v52,48.5 52,48.12 51,47.12 51,45 v52.12,43.88 | 66.92,60.3 67,60 66.92,60.5 63.48,60.5 63.48,58.5 61.62,58.5 60.62,57.5 BATTCONN.P$7
  Bottom 0.3: v67.72,55.48 67.53,55.77 67.2,56.3 67.1,59.9 67,60
LITH_MP_NFLT  (via drill 0.6, 0.61)
  Top 0.254: v68.38,46.02 68.38,41.38 64.88,37.88 55.88,37.88 52.88,40.88 52.88,43.38 53.38,43.88 53.5,43.88 54.62,45 54.62,45.75 53.75,46.62 53.75,48 52,49.75 50.88,49.75 CH1-DM.P$3
  Top 0.3: BATTCONN.P$8 61.6,54.5 63.5,54.5 63.5,53.2 66,50.7 68.08,50.7 v68.38,51
  Bottom 0.254: v68.38,51 v68.38,46.02
  Bottom 0.3: v68.38,51 68.38,51.12
N$1
  Top 0.305: C1.1 28.72,5.17 MAG.10
N$2
  Top 0.3: R15.1 14.95,57.3 R5.2 14.95,57.2 13.9,57.2 12.6,55.9 12.6,54.5 T_AMP.IN+
N$3
  Bottom 0.3: C21.1 64.84,10.05 LTC3112.11
N$4
  Bottom 0.3: LTC3112.14 63.34,11.15 63.29,10.3 62.36,10.18 61.29,9.39 C22.1
N$5
  Bottom 0.3: LTC3112.15 62.85,10.81 62.74,10.7 61.8,10.7 61.57,10.23 60.57,10.23 60.1,10.4 60.1,11.3 59.62,11.78 C23.2
N$6
  Top 0.3: T_AMP.OUT 16.78,56.48 17.4,57.1 17.4,58.6 R13.1 17.5,58.7 R14.2
N$7
  Top 0.3: R13.2 18.15,56.6 T_AMP.IN- 19.4,50.65 R12.1
N$8  (via drill 0.6)
  Top 0.3: R16.2 12,59.9 v12.2,60.1
  Bottom 0.3: v12.2,60.1 12.2,61.45 100T.P$1
N$9
  Top 0.25: 0,0 76.2,0 76.2,76.2 0,76.2 0,0
N$15
  Top 0.3: R32.2 22.85,39.45 PH_AMP_2.IN+ 24.34,37.96 R33.2
N$16
  Top 0.3: 35.75,12 35.75,13.19 37.1,14.54 SAMD21J.P$41
  Top 0.406: MRAM.P1 35.52,9.31 R23.2 35.75,9.47 35.75,12
N$17  (via drill 0.6)
  Top 0.3: R32.1 18.95,39.05 1N4148.CATHODE 18.8,39.3 v18.8,40.4 | v16.97,39.24 16.72,39.22 PH_AMP_1.OUT
  Bottom 0.3: v18.8,40.4 17.98,39.23 v16.97,39.24
N$18
  Top 0.3: SAMD21J.P$42 37.59,12.59 37,12
  Top 0.406: MRAM.P2 35.8,5.55 36.38,6.13 36.38,7.38 37,8 37,12
N$19
  Top 0.3: R35.2 26.4,43.85 R34.1 26.35,43.15 27,42.5 28.7,42.5 29.6,41.6 29.6,40.37 28.67,39.44 PH_AMP_2.IN-
N$36
  Top 0.305: C10.1 26.59,2.71 MAG.8
N$40
  Bottom 0.3: LTC3112.12 LTC3112.13 63.9,11.8 63.8,9.4 63.25,9.55 C22.2 63.29,9.55 L4.1
N$43  (via drill 0.6)
  Top 0.254: v36.35,35.51 36.37,35.51 C2.2
  Top 0.305: SAMD21J.P$8 37.09,33.22 C2.2 | C8.2 3.87,33.94 v5.59,33.94 5.77,33.76 5.77,32.28 4.07,30.59 L1.2
  Bottom 0.254: v5.59,33.94 36.35,33.94 v36.35,35.51
N$44
  Top 0.305: SAMD21J.P$55 44.88,24.95 C4.2
N$45
  Bottom 0.3: L3.2 72.89,41.16 63002.P$2
N$46
  Bottom 0.3: 63002.P$4 71.89,41.56 L3.1
N$48
  Bottom 0.3: L2.2 60.79,38.59 62.54,36.84 63001.P$2
N$50
  Bottom 0.3: 63001.P$4 63.53,37.8 63.41,37.8 L2.1
N$53
  Bottom 0.3: L4.2 66.55,8.17 C21.2 65.84,10.76 LTC3112.9 LTC3112.10
N$54
  Bottom 0.3: R3.2 R4.1 63.45,18.28 62.83,17.66 62.83,16.5 | LTC3112.2 62.83,15.68 62.83,16.5 | R10.2 59.41,15.01 59.4,15 59.42,15 C28.2 59.4,15.12 59.4,16.5 62.83,16.5
N$69  (via drill 0.6)
  Top 0.3: v61.8,17.5 63.8,17.5 v64.2,17.93 66.3,17.9 v68.96,21.95
  Bottom 0.254: R6.2 62.12,24.12 62.12,23 63.62,21.5 C26.1
  Bottom 0.3: LTC3112.3 63.34,17.09 64.05,17.8 v64.2,17.93 | v61.8,17.5 62.5,18.2 62.5,20 63.68,21.18 C26.1 | R7.2 69.3,20.98 v68.96,21.95
N$70
  Bottom 0.3: R10.1 C29.1
N$71
  Bottom 0.3: C29.2 57.68,13.25 C28.1 61.88,15.66 LTC3112.1
N$999
  Bottom 0.3: R4.2 61.5,19.22 61.5,20.2 61.02,20.68 R9.1
P29  (via drill 0.61)
  Top 0.254: v54.5,31.12 48.12,31.12 43.62,35.62 43.62,44.5 37.62,50.5 37.62,52.25 UMBCONN.P$13 | v65.12,27.2 65.12,27.3
  Top 0.406: RAD_SHDN_BUF.P$4 65.12,27.3 67.8,27.3 69.75,29.25 71.94,29.25 RADCONNM.P$5
  Bottom 0.254: v54.5,31.12 59.62,26 64.12,26 v65.12,27.2
PA00  (via drill 0.6)
  Top 0.305: MAG.15 25.59,10.22 25.22,10.59 25.22,12.32 v26.16,13.26 | v30.66,20.12 30.99,20.12 40.64,29.77 40.64,31.15 SAMD21J.P$1
  Bottom 0.305: v26.16,13.26 26.16,15.62 v30.66,20.12
PA07  (via drill 0.6)
  Top 0.3: 49.4,55.4 49.16,55.16 49.16,48.55 48.55,48.55 v47.5,49.6 | SAMD21J.P$16 33.09,43.81 v31.6,45.3 26.05,45.3
  Bottom 0.3: v47.5,49.6 35.9,49.6 v31.6,45.3
PA08  (via drill 0.61)
  Top 0.254: v58.12,41.5 58.75,42.12 58.75,42.88 BAL_1_BUF.P$2 | v35.62,29.88 34.8,29.45 31.39,29.45 SAMD21J.P$17
  Bottom 0.254: v58.12,41.5 57.75,41.5 54.12,37.88 47.12,37.88 46.38,38.62 44.38,38.62 v35.62,29.88
PA09  (via drill 0.6)
  Top 0.3: SAMD21J.P$18 32.33,28.95 32.6,28.68 v32.8,26.9 | v34.3,25.4 v38.7,29.8 | v61.3,40.6 61.8,40.7 62,41.6 62.07,42.16 BAL_2_BUF.P$2
  Route2 0.3: v54.1,34.6 57.4,37.9 59,37.9 v61.3,40.6
  Route3 0.3: v38.7,29.8 38.8,29.7 44.1,29.7 44.2,29.8 44.2,31.7 44.5,32 v45.1,32
  Bottom 0.3: v32.8,26.9 34.3,25.5 v34.3,25.4 | v45.1,32 51.3,33.8 v54.1,34.6
PA10  (via drill 0.61)
  Top 0.254: SAMD21J.P$19 30.61,28.45 29.62,29.5 29.62,35.75 v29,36.38
  Bottom 0.254: v29,36.38 29,36.62 29.75,37.38 29.75,38.12 25.38,42.5 18.88,42.5 15.75,45.62 15.75,47.88 17.62,49.75 21.62,49.75 22.38,49 23.12,49 23.62,49.5 23.62,51.88 22.88,52.62 22.88,54.12 21.88,55.12 R18.1
  Bottom 0.3: TD-DM.P$1 21.8,55.2 R18.1
PA11  (via drill 0.6)
  Top 0.3: v20.52,61.32 21.35,61.1 R19.1 21.85,61.05 23.2,59.7 23.2,59.3 v24.03,58.44 | SAMD21J.P$20 29.75,27.95 29.4,28.3 27.8,29.2 v24.4,32.6 | v22.3,46.5 24.8,49 v26.9,49
  Route3 0.3: v24.4,32.6 23.7,33.3 23.7,37.2 24.5,38 24.5,45.4 23.4,46.5 v22.3,46.5 | v26.9,50.8 28.3,52.2 28.3,54.5 29.4,55.6 29.4,57 28.9,57.5 24.1,57.5 24,57.6 v24.03,58.44
  Bottom 0.3: TD-DM.P$15 21.15,61.55 v20.52,61.32 | v26.9,49 v26.9,50.8
PA13  (via drill 0.61)
  Top 0.254: 28.45,23.4 28,23 27.12,22.12 22.75,22.12 9.5,35.38 v9.5,36.88
  Top 0.3: 28.45,23.4 29.2,23.4 29.65,22.95 SAMD21J.P$30
  Bottom 0.254: v9.5,36.88 9.5,40.38 12.5,43.38 12.5,58.5 11.25,59.75 11.25,64.75 15.5,69 15.5,69.88 16.12,70.5 24.88,70.5 25.5,69.88 25.5,69.12 26.12,68.5 27.5,68.5 DRIVECONN.P$12
PA14  (via drill 0.6)
  Top 0.3: DRIVECONN.P$13 26.5,69.7 27.5,70.7 27.5,73.5 27.4,73.6 12.9,73.8 11.5,72.4 11.4,72.2 10,70.8 10,64.5 9,63.5 9,58.5 4.1,58.5 3.7,58.1 3.7,55.2 2.6,54.1 2.6,47.4 7.9,42.1 7.9,39.3 v5.9,37.3 | v9.9,31 9.9,30.3 v19.1,21.1 | v28.7,22.3 28.85,22.45 SAMD21J.P$31
  Route3 0.3: v5.9,37.3 5.9,36.7 9.4,33.2 9.4,32.9 9.6,32.7 9.6,32.4 9.8,32.2 9.8,31.1 v9.9,31 | v19.1,21.1 19.2,21.1 20.3,20 26.4,20 v28.7,22.3
PA15  (via drill 0.6)
  Top 0.3: SAMD21J.P$32 30.35,21.95 v29.3,20.9 | 17.1,20.6 v17.4,20.4 8.9,28.9 8.9,32 v8.7,32.2 | v5.6,35.7 4.7,36.6 4.7,37.8 6.2,39.3 6.2,40.8 v6.8,41.4 | v11.5,66.3 12.9,66.7 14.6,68.4 14.6,71.3 16.1,72.8 25.4,72.8 25.5,72.7 25.5,70.5 DRIVECONN.P$14
  Route2 0.3: v29.3,20.9 27.8,20.9 26.6,19.7 18.4,19.7 v17.4,20.4 | v8.7,32.2 8.7,32.6 v5.6,35.7
  Route3 0.3: v8.4,49.9 8.4,63.4 11,66 11,66.1 v11.5,66.3
  Bottom 0.3: v6.8,41.4 6.8,48 7.2,48.4 7.2,48.7 v8.4,49.9
PA16  (via drill 0.6)
  Top 0.3: SAMD21J.P$35 34.1,21.6 34.3,21.8 v34.4,21.8 | v24.4,25.7 24.1,26 v24.1,31
  Route2 0.3: v30.3,39.7 30.3,42.9 28.4,44.8 28.4,46.2 v33,50.8
  Route3 0.3: v24.1,31 26.6,33.5 26.6,36.2 25.7,37.1 25.7,39.3 26.1,39.7 v30.3,39.7
  Bottom 0.3: LED_EN_BUF.P$2 31.85,62.25 32,62.1 32,59.8 32.6,59.3 32.6,51.2 v33,50.8 | v34.4,21.8 30.5,25.7 v24.4,25.7
PA17  (via drill 0.6, 0.61)
  Top 0.21: 34.56,17.49 34.56,20.17 SAMD21J.P$36
  Top 0.254: v28.12,55.75 31.62,55.75 33,54.38 33.5,54.38 UMBCONN.P$6 | v21,43.88 21,40.25 21.5,39.75 v21.5,28.38
  Top 0.3: R40.2 15.6,12.65 IR_NMOS.P$4 15.59,12.66 v15.59,15.15 | v22.99,16.77 24.5,18.25 27,18.25 27,17 29.75,14.25 31.32,14.25 34.56,17.49
  Bottom 0.254: v28.12,55.75 25.25,55.75 23.75,54.25 23.75,52.5 24.12,52.12 24.12,47 v21,43.88 | v21.5,28.38 20.75,27.62 20.75,16.75
  Bottom 0.3: v15.59,15.15 17.49,16.75 20.75,16.75 v22.99,16.77
PA18  (via drill 0.6)
  Top 0.3: SAMD21J.P$37 35.08,16.68 34.5,16.1 v34.5,16 | v39.25,14.5 43.75,14.5 45.25,13 45.25,10.5
  Top 0.406: MRAM.P5 44.45,3.02 R28.1 45.2,7.2 45.25,7.75 45.25,10.5
  Bottom 0.3: v34.5,16 36,14.5 v39.25,14.5
PA19  (via drill 0.6)
  Top 0.3: SAMD21J.P$38 35.59,15.34 v33.75,13.5 | v43.5,12.25 44.25,11.5 44.25,10.75
  Top 0.406: MRAM.P6 42.53,4.29 43.25,5 44.42,8.52 R29.1 44.25,8.75 44.25,10.75
  Bottom 0.3: v33.75,13.5 37.5,13.5 39.75,11.25 42.5,11.25 v43.5,12.25
PA22  (via drill 0.61)
  Top 0.254: v35.62,23.5 38.09,21.01 38.09,20.26 SAMD21J.P$43 | v28.75,31.12 28.75,32.5 v24.88,36.38 | v16.62,43.5 v16.62,41
  Bottom 0.254: v35.62,23.5 33.75,23.5 27.88,29.38 27.88,30.25 v28.75,31.12 | v24.88,36.38 24.12,36.38 19.25,41.25 16.88,41.25 v16.62,41 | v16.62,43.5 16.62,44 13.25,47.38 13.25,53.88 15.25,55.88 15.25,60.38 14,61.62 14,66.38 16.12,68.5 21.5,68.5 DRIVECONN.P$15
PA23  (via drill 0.6)
  Top 0.3: DRIVECONN.P$16 21.5,68.5 21.5,66.5 21.8,66.2 23.4,66.2 v24.5,65.1 | v22.9,32.5 23.3,32.1 23.3,23.4 v23.4,23.3 | v23.4,20.9 27,20.9 v28.3,19.6 | v39.33,12.99 38.2,13.2 38.6,19.1 SAMD21J.P$44
  Route3 0.3: v26.8,61.2 26.8,60.2 v25.8,59.26 | v24.2,56 24.2,54.7 23.9,54.4 23.9,52.1 v25.2,50.8 | v23.3,44.8 23.3,41.3 23.5,41.1 23.5,38.4 22.1,37 22.1,36.9 21.5,36.3 21.5,33.9 v22.9,32.5 | v28.3,19.6 35,17.8 v39.33,12.99
  Bottom 0.3: v24.5,65.1 24.5,64 27,61.5 27,61.4 v26.8,61.2 | v25.8,59.26 25.8,57.6 v24.2,56 | v25.2,50.8 25.2,46.7 v23.3,44.8 | v23.4,23.3 v23.4,20.9
PA24
  Top 0.3: TX_BUF.P$2 61.25,21.7 58.3,21.7 52.1,15.5 39.1,15.5 39.09,15.51 SAMD21J.P$45
PA25
  Top 0.3: RX_BUF.P$4 58.4,26.1 57.4,27.1 56.9,27.1 55,25.2 55,21.8 49.3,16.1 40.5,16.1 39.59,17.01 SAMD21J.P$46
PA27  (via drill 0.6)
  Top 0.3: CH1-DM.P$7 50.05,47.25 49.6,46.8 49.6,45.4 R22.1 50.7,44.5 v49.4,43.2 | SAMD21J.P$51 43.47,22.95 43.82,22.6 v50.6,22.6 | v52.6,32 51.9,32.7 51.9,36 49.6,38.3 v49.6,39
  Route2 0.3: v50.6,22.6 51.7,23.7 51.7,26.2 54.2,28.7 54.2,29.5 52.6,31.1 v52.6,32
  Route3 0.3: v49.6,39 49.4,39.2 v49.4,43.2
PA28  (via drill 0.6)
  Top 0.3: CH2-DM.P$7 49.7,54.1 49.7,52.4 49.74,52.36 | 49.74,52.36 R31.1 | 49.74,52.36 49.8,52.3 v50.2,52.3 | v49.4,23.7 48.9,23.2 44.8,23.2 44.05,23.95 SAMD21J.P$53
  Route2 0.3: v50.2,35 51.7,33.8 51.7,32.5 51.4,32.2 51.4,28.4 49.4,26.4 v49.4,23.7
  Route3 0.3: v42.8,44 45.1,41.7 45.1,39.1 45.5,38.7 46.4,38.7 49.7,35.4 v50.2,35
  Bottom 0.3: v50.2,52.3 49.9,52 49.9,48.7 45.2,44 v42.8,44
PA30  (via drill 0.6)
  Top 0.254: 42.36,25.93 SAMD21J.P$57
  Top 0.3: SAMD21J.P$57 43.31,25.96 44.8,27.2 46.2,27.2 v46.9,27.9 | v49.8,31.9 48,33.7 v48.1,38.7 | v47.4,43.1 v48.6,45 48.6,44.9 | v42.8,47 42.6,47.2 42.6,53.3 41.6,54.3 UMBCONN.P$2
  Route2 0.3: v46.9,27.9 49.8,30.8 v49.8,31.9 | v48.6,45 46.4,47 v42.8,47
  Route3 0.3: v48.1,38.7 v47.4,43.1
  Bottom 0.3: UMBCONN.P$2 39.7,57.45 38.6,57.45 37.91,58.14 PROGCONN.9
PA31  (via drill 0.61)
  Top 0.254: v43.92,27.6 43.12,26.5 42.38,26.5 SAMD21J.P$58 | v44.5,36 44.5,45.38 44.25,45.62 44.25,51.5 44.62,51.88 44.62,54.75 44,55.38 40.62,55.38 UMBCONN.P$3
  Bottom 0.254: v43.92,27.6 44.12,35.62 v44.5,36
  Bottom 0.3: UMBCONN.P$3 36.54,58.61 PROGCONN.10
PB00  (via drill 0.6)  (3 unrouted)
  Top 0.3: PH_AMP_2.OUT 24.34,43.59 R34.2 22.4,43.8 v19.6,46.6 | v18.04,61.15 18.2,60.66 R14.1 | v18.12,55.12 18.1,54.1 18.4,53.7 18.55,53.55 C17.1 17.9,51.85 v17.9,48.8
  Bottom 0.3: v18.04,61.15 17.8,60.5 TD-DM.P$7 17.9,55.7 v18.12,55.12 | v17.9,48.8 19.6,47.1 v19.6,46.6
PB01  (via drill 0.61)
  Top 0.254: v54.88,26.75 56.12,28 60.38,28 60.5,27.98 61.75,27.98 RAD_SHDN_BUF.P$2 | v45.27,28.05 44.73,28.35 44.38,28.42 42.38,28.42 SAMD21J.P$62
  Bottom 0.254: v54.88,26.75 46.38,26.75 v45.27,28.05
PB02  (via drill 0.6)
  Top 0.3: TX_BUF.P$1 58.79,22.4 R11.1 v55.9,22.6 | v48.52,27.86 47.5,28.94 42.39,28.94 SAMD21J.P$63
  Route3 0.3: v50.6,25.8 v48.52,27.86
  Bottom 0.3: v55.9,22.6 53.8,22.6 v50.6,25.8
PB03  (via drill 0.61)
  Top 0.254: v52.88,29.5 42.38,29.5 SAMD21J.P$64 | v57,25.88 57.38,25.5 57.5,25.5
  Top 0.3: R38.2 65.6,24.8 RX_BUF.P$1 63.06,24.8 62.46,25.4 57.6,25.4 57.5,25.5
  Bottom 0.254: v52.88,29.5 53.38,29.5 v57,25.88
PB06  (via drill 0.6)
  Top 0.3: v45.5,30.4 43.2,30.4 v42.9,30.7 | v36.1,32.6 36.6,32.1 SAMD21J.P$9
  Route3 0.3: v53.1,25.1 v49.5,28.7 | v42.9,30.7 38,30.7 v36.1,32.6
  Bottom 0.3: LTC3112.7 65.36,15.68 65.36,20.02 64.77,20.61 R8.2 64.66,21.47 C27.1 63.97,23.73 62.7,25 58.8,25 58.8,23.5 58.3,23 57,23 54.9,25.1 v53.1,25.1 | v49.5,28.7 47.2,28.7 v45.5,30.4
PB10  (via drill 0.6, 0.61)
  Top 0.254: v16.62,46 13.62,46 PH-DM.P$9 | v57.62,51.75 57.62,52.25 56.38,53.5 CH2-DM.P$9 | v59.3,49 58.5,47.88 57.25,46.62 56.38,46.62 CH1-DM.P$9 | v57,59.25 56.38,59.88 56.38,60.5 T-DM.P$9
  Top 0.3: SAMD21J.P$23 29.55,26.45 29.2,26.1 28.1,26.1 28,26 26.5,26 v24.8,24.3 | v21.8,21.6 v10.7,32.4 | v13.6,44 13.6,46.02 PH-DM.P$9
  Route2 0.3: v10.7,32.4 10.7,41.1 v13.6,44
  Bottom 0.254: v16.62,46 17.62,46 20.62,43 45.25,43 52.94,50.69 | 52.94,50.69 53.48,51.33 55.94,51.34 57,51.12 v57.62,51.75 | v57,59.25 57,60.25 55.5,61.75 53.25,61.75 52.12,60.62 50.88,60.62 49.5,59.25 47.38,59.25 46.75,58.62 46.75,56.38 47.5,55.62 48,55.62 52.94,50.69
  Bottom 0.3: v59.3,49 58.7,49.9 56.3,49.9 56.1,50 55.94,51.34 | v24.8,24.3 23,24.3 21.8,23.2 v21.8,21.6
PB11  (via drill 0.61)
  Top 0.254: v36.88,29.88 33,26 31.38,26 SAMD21J.P$24 | v51.25,43 v46,37.75 | v53.75,43 57.12,43 58.25,44.12 62.88,44.12 v66,47.19 | v65.95,58.92 65.25,58.52 64.88,58.5 61.5,58.5 BATTCONN.P$6
  Bottom 0.254: v36.88,29.88 36.88,30.38 44.25,37.75 v46,37.75 | v53.75,43 v51.25,43 | v66,47.19 66,51 65.75,51.25 v65.95,58.92
PB12  (via drill 0.6, 0.9)
  Top 0.305: MAG.16 25.09,8.26 R2.2 24.52,12.75 24.52,13.32 v24.41,13.71 | 27.56,25.45 SAMD21J.P$25
  Top 0.41: v26.75,24.64 27.56,25.45 | 24.52,12.75 24.42,12.65 R25.1 22.1,12.65 16.25,18.5 CONNSIDE4.P$3
  Route2 0.76: CONNSIDE5.P$3 51.75,5.55 51.75,3.75 51,3 33.75,3 31,5.75 31,10.25 24.52,10.25 24.61,10.34 v24.41,13.71 | 3.5,59.5 1.75,59.5 1.75,47 5,43.75 5,40.25 1.25,36.5 1.25,33 1.75,32.5 1.75,24.75 3,23.5 3,21.5 4.5,20 6.25,20 6.8,19.45 CONNSIDE4.P$3 | CONNSIDE3.P$3 3.5,59.5 | 3.5,59.5 v3.1,66 | 34.5,72.45 34.5,73.75 33.55,74.7 11.4,74.7 11,74.3 v11.1,73.5 | DRIVECONN.P$10 34.5,69.5 34.5,72.45 | 34.5,72.45 52.35,72.45 53,71.9 53,71.75 | 53,69.25 53,69.19 CONNSIDE2.P$3 51.51,67.76 53,69.25 | 53,69.25 53,71.75 | 53,71.75 65.5,71.75 65.5,72.75 v66,73.25
  Bottom 0.41: v24.41,13.71 24.61,22.5 v26.75,24.64
  Bottom 0.76: v66,73.25 66,71.75 66.75,71 66.75,67.5 67,67.25 71.5,67.25 72.5,66.25 72.5,56 72,55.5 69.25,55.5 68.2,56.55 CONNSIDE1.P$3 | v3.1,66 7.25,66 9,67.75 9,72 v11.1,73.5
PB13  (via drill 0.6, 0.9)
  Top 0.3: MAG.1 23.83,6.17 v23.55,7.25
  Top 0.32: SAMD21J.P$26 28.45,24.95
  Top 0.35: 28.45,24.95 v26.75,23
  Top 0.41: v26,17.25 25.5,15.5 | R1.2 28.23,9.77 27.5,10.5 v27.7,14.35 27.5,15 27,15.5 25.5,15.5 | 25.5,15.5 R24.1 | CONNSIDE4.P$2 11.05,12.25 v14,12.25
  Route3 0.76: CONNSIDE5.P$2 53.3,9 31.75,9 30.75,10 30.75,14 30.5,14.25 v27.7,14.35 | 2,57.5 1.75,57.5 1.75,47 5,43.75 5,40.25 1.25,36.5 1.25,33 1.75,32.5 1.75,25.75 3,24.5 8.25,24.5 8.25,17.5 7.25,16.5 CONNSIDE4.P$2 | CONNSIDE3.P$2 2,57.5 | 2,57.5 2,62.25 5.5,65.75 7,65.75 9,67.75 9,73 10.75,74.75 34.25,74.75 | DRIVECONN.P$9 34.25,69.25 34.25,74.75 | 34.25,74.75 52.75,74.75 53,74.5 53,71.25 | 53,71.25 53,66.25 50,66.25 50,67.21 CONNSIDE2.P$2 | CONNSIDE1.P$2 67.5,59 66.5,60 66.5,71 66.25,71.25 53,71.25
  Bottom 0.3: v23.55,7.25 23.65,10.05 23.9,10.5 27,10.5 27.5,11 v27.7,14.35
  Bottom 0.41: v26.75,23 v26,17.25 | v14,12.25 15.75,10.5 23.9,10.5
PB16
  Top 0.3: 34.75,12 34.75,13.56 36.1,14.91 SAMD21J.P$39
  Top 0.406: MRAM.P3 33.97,4.29 32.5,5.75 32.5,7.4 R26.1 33.95,7.45 34.75,8.25 34.75,12
PB17  (via drill 0.6)
  Top 0.3: SAMD21J.P$40 36.59,21.27 v36.36,21.6 | 41.5,12.5 v41,12.5
  Top 0.406: MRAM.P7 42.55,5.55 43.3,7.55 R27.1 43.25,8.65 43.25,10.75 41.5,12.5
  Bottom 0.3: v36.36,21.6 36.58,18.92 41,14.5 v41,12.5
PB22  (via drill 0.6, 0.61)
  Top 0.254: v40.25,21.88 42.25,21.88 SAMD21J.P$49 | v6.25,48.88 9.25,51.88 9.25,55.75 9.75,56.25 11.1,56.25 | v57.62,48.25 57.38,48 56.38,48 CH1-DM.P$11 | v55.5,40.5 55.5,39.5 v56.25,38.75 | CH2-DM.P$11 55.75,54.75 v54.9,55.5 | 55.12,61.9 v55.12,60.88
  Top 0.3: v42.79,62.33 32.9,62.5 31.6,63.8 26.8,63.8 26.7,63.9 v21.2,63.9 16.7,63.9 15.7,64.9 14.8,64.9 11.1,61.2 11.1,56.25 11.1,50.8 12.2,49.8 12.25,49.75 PH-DM.P$11 | v52.2,61.9 55.12,61.9 56.31,61.9 T-DM.P$11
  Bottom 0.254: 38.81,23.31 31.62,30.5 31.62,31.62 31.12,32.12 29.75,32.12 28.5,33.38 6.5,33.38 6.12,33 2.75,33 1.5,34.25 1.5,37.25 6.25,42 v6.25,48.88 | 38.81,23.31 v40.25,21.88 | v57.62,48.25 57.62,47.75 55.5,45.62 v55.5,40.5 | v56.25,38.75 55.75,38.75 53.88,36.88 44.12,36.88 40.12,32.88 40.12,28.12 40.8,27.45 40.8,26.7 38.81,23.31 | v54.9,55.5 55,56.88 56.12,58 56.12,59.88 v55.12,60.88
  Bottom 0.3: TD-DM.P$14 20.5,63.2 v21.2,63.9 | v42.79,62.33 51.6,62.5 v52.2,61.9
PB23  (via drill 0.6, 0.61)
  Top 0.254: v38.12,26 41.62,22.5 42.25,22.5 SAMD21J.P$50 | v34.75,33 34.75,38.5 33.62,39.62 33.62,44.5 28.25,49.88 v22.75,49.88 | v34.62,61.62 32.75,59.75 28.5,59.75 v28.38,59.91
  Top 0.3: PH-DM.P$10 12.9,52.1 v14.1,53.3 | CH2-DM.P$10 53.6,54.1 v53.7,53.9 | v58.1,60 58,61.2 T-DM.P$10 | CH1-DM.P$10 55.25,47.25 v55.2,47.3
  Route3 0.3: v58.1,60 56.7,54.8 v53.7,53.9 53.7,50.5 54.6,49.6 54.1,48.7 54.2,47.6 54.5,47.3 v55.2,47.3
  Bottom 0.254: v38.12,26 34.75,29.38 v34.75,33 | v22.75,49.88 19.38,53.25 19.38,53.3 | v58.1,60 54.62,63.38 42.25,63.38 41.38,62.5 35.5,62.5 v34.62,61.62 | v28.38,59.91 24.93,60.48 22.38,57.88 21.5,57.88 21.25,57.62 21.25,57 TD-DM.P$2
  Bottom 0.3: v14.1,53.3 19.38,53.3 19.8,53.3 20.6,54.1 20.6,55.73 21.15,56.28 TD-DM.P$2
PB30  (via drill 0.6)
  Top 0.3: T-DM.P$7 48.1,61.2 R20.1 46.3,59.4 v45.5,59.4 | v45.2,51.3 46.4,49.8 v46.4,39.7 | v41.03,25.49 41.19,26.81 41.2,26.9 41.75,26.95 SAMD21J.P$59
  Route2 0.3: v42.9,34.3 42.6,34 42.6,32.2 41.9,31.5 41.9,25.5 v41.03,25.49
  Route3 0.3: v44.9,55.6 44.8,55.5 44.8,51.9 45.1,51.6 v45.2,51.3 | v42.7,38.4 42.9,38.2 v42.9,34.3
  Bottom 0.3: v45.5,59.4 44.9,58.8 v44.9,55.6 | v46.4,39.7 46,39.3 43.6,39.3 v42.7,38.4
PB31  (via drill 0.61)
  Top 0.254: v39.92,26.88 40.33,27.47 42.24,27.45 SAMD21J.P$60 | v31.25,33 31.25,35.38 v28.88,37.75 | v14.88,41.88 14,42.75 13.12,42.75 12.5,42.12 12.5,41.38 12.88,41 12.88,40.5 PH-DM.P$7
  Top 0.3: R21.1 12.35,38.75 12.9,39.3 PH-DM.P$7
  Bottom 0.254: v39.92,26.88 39.75,26.38 38.5,25.12 37.75,25.12 32.12,30.75 32.12,32.12 v31.25,33 | v28.88,37.75 24.75,41.88 v14.88,41.88
PD1_OUT  (via drill 0.6)
  Top 0.3: v11.6,43.8 11.6,42.43 11.02,41.85 11.24,42.05 10.97,41.78 10.97,40.48 PH-DM.P$4
  Route2 0.3: v8.9,74.8 8.8,74.3 10.9,72.2 v12.6,71.9
  Bottom 0.3: CONNSIDE1.P$1 65.6,63.6 65.6,70.1 65.2,70.5 59.7,70.5 55.4,74.8 v8.9,74.8 | v11.6,43.8 10.9,44.5 10.9,50.3 9.3,51.9 9.3,65.4 11.1,67.2 13,67.2 14.4,68.6 14.4,70.4 12.9,71.9 v12.6,71.9
PD2_OUT  (via drill 0.6)
  Top 0.3: CONNSIDE2.P$1 46.3,68.91 46.3,70.8 43.5,73.6 v37.1,73.7 | v10.3,43.3 PH-DM.P$3
  Bottom 0.3: v37.1,73.7 12.7,73.7 9.9,70.9 9.9,67 8.5,65.6 8.5,51.4 10.3,49.6 v10.3,43.3
PD3_OUT
  Top 0.3: PH-DM.P$2 9.65,41.95 3.2,48.4 3.2,53.5 CONNSIDE3.P$1
PD4_OUT  (via drill 0.6)
  Top 0.3: v5.7,26.6 5.7,31 6.7,32 6.7,37.1 9,39.4 PH-DM.P$1
  Bottom 0.3: CONNSIDE4.P$1 7.5,14.5 8.9,15.9 8.9,23.4 v5.7,26.6
PD5_OUT  (via drill 0.6)
  Top 0.3: CONNSIDE5.P$1 53.4,10.9 v46.6,10.9 | v28.8,16.8 27.7,17.9 27.7,18.6 27.1,19.3 11.5,19.3 7.8,23.7 v7.8,36.5 | v8.9,44.5 9.65,45.25 PH-DM.P$15
  Bottom 0.3: v46.6,10.9 44.8,9.1 40.2,9.1 37,12.3 33.2,12.3 28.8,16.7 v28.8,16.8 | v7.8,36.5 8.9,37.6 v8.9,44.5
PD_OUT  (via drill 0.6)
  Top 0.3: PH-DM.P$14 10.3,46.9 10.1,47.1 v10.1,55.3 | v10.1,59.3 10.1,62.9 15.7,68.5 17.5,68.5 17.5,70.5 23.5,70.5 23.5,68.5 29.5,68.5 DRIVECONN.P$11
  Bottom 0.3: v10.1,55.3 v10.1,59.3
PH_IN  (via drill 0.6)
  Top 0.3: PH_AMP_1.IN- 13.3,35.88 v13,35.7 12.2,34.6 11.8,34.2 10.4,35.6 10.4,38.7 11.4,39.7 11.5,39.7 11.6,39.8 PH-DM.P$5 | 1N4148.ANODE 18.8,36.4 v19.6,36.4
  Bottom 0.3: v13,35.7 13.3,36.4 v19.6,36.4
R2  (via drill 0.6, 0.61)
  Top 0.254: v42.75,41.12 42.88,41.25 42.88,42.5 33.62,51.75 33.62,52.25 UMBCONN.P$11 | v56.75,33.38 v51.38,38.75 | 65.12,29.75 v58.88,29.75 | v68.38,26.5 68.88,26.5 70.12,27.75 71.25,27.75 RADCONNM.P$6
  Top 0.3: SEND.A 64.13,13.12 65.75,11.5 72.05,11.5 72.4,13.85 75,13.9 v74.55,26.85 | 65.12,29.75 65.15,29.75 66.1,28.8 67.83,28.8 v68.25,29.23
  Bottom 0.254: v42.75,41.12 49,41.12 v51.38,38.75 | v56.75,33.38 56.75,31.88 v58.88,29.75 | v68.38,26.5 v68.25,29.23
  Bottom 0.3: v74.55,26.85 72.34,26.85 RADCONNM.P$6
R3  (via drill 0.61)
  Top 0.254: v41,32.38 41,34.38 38.88,36.5 37.5,36.5 34.5,39.5 34.5,44.38 28.5,50.38 28.5,52.75 29.5,53.75 29.5,54.25 UMBCONN.P$8 | v55.88,17.75 60.62,17.75 63.88,21 TX_BUF.P$4
  Top 0.406: TX_BUF.P$4 66.85,21.1 69.1,23.45 69,23.5 RADCONNM.P$7
  Bottom 0.254: v41,32.38 41,29.38 52.62,17.75 v55.88,17.75
R4  (via drill 0.61)
  Top 0.254: v42,42.12 v34.5,49.62 | v51.25,41 58.5,33.75 65.62,33.75 66.12,34.25 v73.75,34.25
  Top 0.3: RET.A 70.33,15.42 69.75,16.5 69.75,22.25 RADCONNM.P$8
  Bottom 0.254: v34.5,49.62 35.5,50.62 35.5,52.25 UMBCONN.P$12 | v42,42.12 50.12,42.12 v51.25,41 | v73.75,34.25 73.75,33.38 74.75,32.38 74.75,30.25 73.38,28.88 70.88,28.88 70.25,28.25 70.25,24.88 71.25,23.88 RADCONNM.P$8
R12  (via drill 0.6, 0.61)
  Top 0.254: v36.25,39 37.38,40.12 37.38,44.5 36.62,45.25 36.38,45.25 35.88,45.75 35.88,46.5 31.62,50.75 31.62,52.25 UMBCONN.P$10 | v22.77,35.88 22.88,35.62 v28.75,29.75 | v55.12,14.5 67.08,14.5 v67.45,14.45
  Top 0.3: PWR_ON.A 67.71,13.71 v67.45,14.45
  Route3 0.3: v67.45,14.45 72.45,13.95 74.9,14.5 74.9,21.79 RADCONNM.P$3
  Bottom 0.254: v36.25,39 34.5,39 31,35.5 23.25,35.5 v22.77,35.88 | v28.75,29.75 31.12,29.75 40.2,20.68 48.55,20.77 v55.12,14.5
R14  (via drill 0.61)
  Top 0.254: v36,43.88 29.62,50.25 29.62,52.25 UMBCONN.P$9 | v38.75,43.88 38.75,39.75 47.62,30.88 v47.62,30.38 | v68.17,25 66.88,25.45
  Top 0.3: 70.09,26.84 72.38,26.84
  Top 0.406: RX_BUF.P$2 66.88,25.45 68.7,25.45 70,26.75 70,26.76 70.09,26.84 | 72.38,26.84 RADCONNM.P$4
  Bottom 0.254: v38.75,43.88 v36,43.88 | v47.62,30.38 54,30.38 58.88,25.5
  Bottom 0.3: 58.88,25.5 58.92,25.45 67.72,25.45 v68.17,25
RESETN  (via drill 0.61)
  Top 0.254: SAMD21J.P$52 42.25,23.5 41.62,23.5 39.75,25.38 38.75,26.93 41.88,30.25 41.88,35.88 37.88,39.88 37.88,45 v36.75,46.12
  Bottom 0.254: v36.75,46.12 43.75,46.12 44.75,45.12 45.5,45.12 48.88,48.5 48.88,50.25 48.12,51 46.55,51.1 44.92,52.73 44.62,53.25 43.62,54.25 UMBCONN.P$1
  Bottom 0.3: UMBCONN.P$1 41.62,58.63 PROGCONN.6
SETC  (via drill 0.6)
  Top 0.305: C10.2 29.87,2.43 v29.98,2.71 | v27.62,7.39 27.11,6.62 MAG.12
  Bottom 0.305: v29.98,2.71 29.89,7.55 v27.62,7.39
SHDN_N
  Top 0.25: DRIVECONN.P$27 33,72 38.7,72 41.3,69.4 41.3,66.6 41.4,66.5 53,66.5 53,71.1 58.2,71.1 58.7,70.6 63.4,70.6 BATTCONN.P$19
  Route2 0.3: BATTCONN.P$19 64.3,69.5
  Bottom 0.25: UMBCONN.P$7 31.5,59.9 29.9,61.5 29.9,63.75 30.48,64.33 | 30.48,64.33 LED_EN_BUF.P$4 | R37.2 29.8,65 30.48,64.33
  Bottom 0.3: LED_EN_BUF.P$4 31.2,66.1 31.5,66.4 31.5,70.5 DRIVECONN.P$27
TEMP_IN  (via drill 0.6)
  Top 0.3: v15.1,63.7 15.1,62.8 | 15.1,62.8 15.1,60.4 R15.2 | T-DM.P$5 44.5,62.5 41,59 28,59 23.1,63.1 22.5,63.1 21.2,62.6 15.3,62.6 15.1,62.8
  Bottom 0.3: TD-DM.P$9 16.93,62.25 100T.P$3 15.05,63.65 v15.1,63.7
UMB_ENABLE  (via drill 0.61)
  Top 0.254: 57.88,40.5 59.88,40.5 61.38,42 61.38,42.75 BAL_2_BUF.P$1 | 57.88,40.5 57.25,41.12 57.25,42 BAL_1_BUF.P$1 | RAD_SHDN_BUF.P$1 58.65,28.6 v57.62,29.62 | 57.88,40.5 v57.88,39.12 | v46.5,36 45.12,37.38 v45.12,46
  Bottom 0.254: v57.62,29.62 57.62,30.25 55.88,32 55.88,36 | 55.88,36 55.88,37.12 v57.88,39.12 | v46.5,36 55.88,36 | v45.12,46 48.38,49.25 48.38,50 47.88,50.5 39.62,50.5 R36.2
  Bottom 0.3: R36.2 39.6,50.55 UMBCONN.P$14 38.6,53.35 38.6,54.7 32.5,60.8 LED_EN_BUF.P$1
VIN  (via drill 0.6, 1.5)
  Top 0.25: CH2-DM.P$15 57.45,57.35 v58.2,56.6
  Route2 0.25: v58.2,56.6 58.4,56.4 58.5,56.5 63.9,56.5 64.5,57.1 BATTCONN.P$25
  Route3 0.3: 60.35,15.15 60.35,15.55
  Route3 0.8: v61,11 59.6,11.5 59.6,14.4 60.35,15.15
  Route3 1: 63.25,15.5 v64.5,16.75
  Route3 1.4: BATTCONN.P$23 BATTCONN.P$24 BATTCONN.P$25 65.5,57.5 66.25,56.75 66.45,53.25 64.8,51.3 65,51.1 65.7,50.3 65.6,48.9 65.6,48.8 65.5,48.7 69.1,48.1 70.4,47.2 | v66.6,29.9 66.7,25.75 | 60.35,19.8 v60.35,18.7 60.35,15.55 61,15.5 63.25,15.5
  Route3 1.8: v66.5,36.1 v66.6,29.9 | 66.7,25.75 60.35,19.8
  Route3 2: 70.4,47.2 69.2,41.1 66.5,38.5 v66.5,36.1 66.5,36.6 v71.1,36.6
  Bottom 0.254: LTC3112.4 63.88,15.62 64,15.62 LTC3112.5 | LTC3112.6 64.75,15.62 64.5,15.81 | v66.5,36.1 66.75,36.38 66.75,39.75 69.62,42.62 v69.82,43.02
  Bottom 0.3: 63002.P$5 70.97,43 70.9,43 | 63002.P$8 63002.P$7 | 63001.P$5 64.28,36.08 64.3,36.1 | C19.1 58.99,18.7 v60.35,18.7 | LTC3112.16 62.34,11.51 62.23,11.4 61.6,11.4 61.2,11 v61,11
  Bottom 0.41: 63.55,32.7 63.53,32.72 63001.P$7 63001.P$6
  Bottom 0.51: v69.95,45.5 70.59,46.34 63002.P$6 63002.P$7
  Bottom 0.76: v64.5,16.75 64.5,15.81 LTC3112.5 | 70.9,43 v69.82,43.02 v69.95,44.25 v69.95,45.5 69.71,45.54 C14.2 | 64.3,36.1 v66.5,36.1 | v66.6,29.9 66.49,29.91 C12.1 64.1,29.94 64.1,31.1 63.55,31.65 63.55,32.7
  pour Bottom (no thermals): 63,33.5 63,32.8 64.2,32.8 64.2,33.5

## Text on the board
tPlace: -Z | -Y Side | +X | -X | +Z
bPlace: -Z | +X | -X | EquiSat: Control Board V2.0 / April 2016 / Ryan Izant | +Z
tNames: 5V | Vin | 3V3 | EquiSat: Control Board V2.0 / April 2016 / Ryan Izant | 3V6 | PB13 | PB12 | GND
bNames: +Y Side | 5V | Vin | 3V3 | PB13 | PB12 | GND